# Altium project Motherboard.PrjPcb (part 1 of 2)
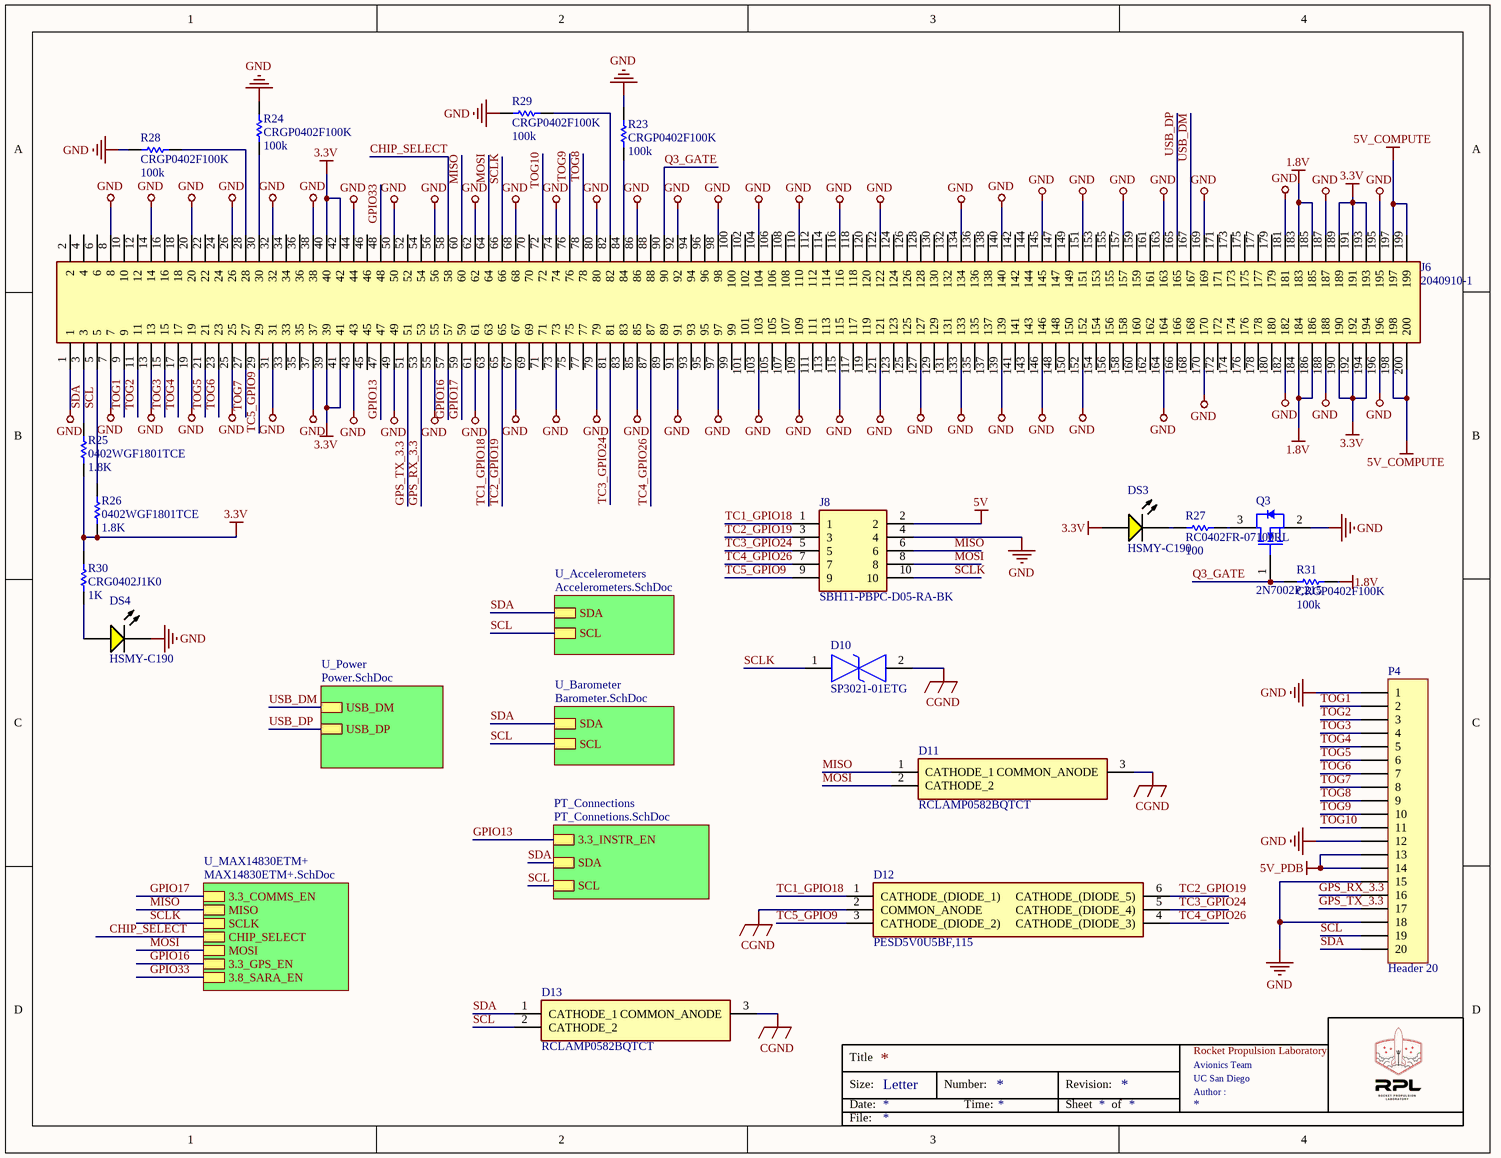
[diagram p0: Top.SchDoc]
9 sheets, 120 parts. Net scope: hierarchical (ports join the sheet entries above them; power ports are global).
Board file: FCB_REV3.PcbDoc
Sheets:
  Top.SchDoc
    U_Accelerometers = Accelerometers.SchDoc
    U_Barometer = Barometer.SchDoc
    U_MAX14830ETM+ = MAX14830ETM+.SchDoc
      U_Cell_SARA-G350-02S = Cell_SARA-G350-02S.SchDoc
      U_MAX3488AEGSA+ = MAX3488AEGSA+.SchDoc
      U_GPS_MAX-M8C-0-10 = GPS_MAX-M8C-0-10.SchDoc
    U_Power = Power.SchDoc
    PT_Connections = PT_Connetions.SchDoc

## Sheet Top.SchDoc
size Letter

### Parts
D10  SP3021-01ETG  [SP302101ETG]
D11  RCLAMP0582BQTCT  [SOT50P160X90-3N]
D12  PESD5V0U5BF,115  [PESD5V0U5BF115]
D13  RCLAMP0582BQTCT  [SOT50P160X90-3N]
DS3  HSMY-C190  [AVAG-HSMX-C190_V]
DS4  HSMY-C190  [AVAG-HSMX-C190_V]
J6  2040910-1  [20409101]
J8  SBH11-PBPC-D05-RA-BK  [SHDRRA10W64P254_2X5_1270X910X880P]
P4  Header 20  [HDR1X20]
Q3  2N7002P,215  [NXP-SOT23_L]
R23  CRGP0402F100K  value 100k  [0402]
R24  CRGP0402F100K  value 100k  [0402]
R25  0402WGF1801TCE  value 1.8K  [0402]
R26  0402WGF1801TCE  value 1.8K  [0402]
R27  RC0402FR-07100RL  spec: 100  [RESC1005X40X25ML05T10]
R28  CRGP0402F100K  value 100k  [0402]
R29  CRGP0402F100K  value 100k  [0402]
R30  CRG0402J1K0  value 1K  [0402]
R31  CRGP0402F100K  value 100k  [0402]

### Sub-sheets
PT_Connections = PT_Connetions.SchDoc: 3.3_INSTR_EN, SDA, SCL
U_Accelerometers = Accelerometers.SchDoc: SDA, SCL
U_Barometer = Barometer.SchDoc: SDA, SCL
U_MAX14830ETM+ = MAX14830ETM+.SchDoc: 3.3_COMMS_EN, MISO, SCLK, CHIP_SELECT, MOSI, 3.3_GPS_EN, 3.8_SARA_EN
U_Power = Power.SchDoc: USB_DM, USB_DP

### Nets
1.8V: J6.183 J6.184 J6.185 J6.186 R31.2
3.3V: DS3.1(A) J6.39 J6.40 J6.41 J6.42 J6.189 J6.190 J6.191 J6.192 J6.193 J6.194 R25.1 R26.1 R30.1
5V: J8.2
5V_COMPUTE: J6.197 J6.198 J6.199 J6.200
5V_PDB: P4.13 P4.14
CGND: D10.2 D11.3(COMMON_ANODE) D12.2(COMMON_ANODE) D13.3(COMMON_ANODE)
GND: DS4.2(K) J6.1 J6.7 J6.8 J6.13 J6.14 J6.19 J6.20 J6.25 J6.26 J6.31 J6.32 J6.37 J6.38 J6.43 J6.44 J6.49 J6.50 J6.55 J6.56 J6.61 J6.62 J6.67 J6.68 J6.73 J6.74 J6.79 J6.80 J6.85 J6.86 J6.91 J6.92 J6.97 J6.98 J6.103 J6.104 J6.109 J6.110 J6.115 J6.116 J6.121 J6.122 J6.127 J6.133 J6.134 J6.139 J6.140 J6.145 J6.146 J6.151 J6.152 J6.157 J6.163 J6.164 J6.169 J6.170 J6.181 J6.182 J6.187 J6.188 J6.195 J6.196 J8.4 P4.1 P4.12 P4.15 P4.18 Q3.2(S) R23.2 R24.2 R28.2 R29.2
CHIP_SELECT: J6.58 ; sheet U_MAX14830ETM+/CHIP_SELECT
GPIO13: J6.47 ; sheet PT_Connections/3.3_INSTR_EN
GPIO16: J6.57 ; sheet U_MAX14830ETM+/3.3_GPS_EN  [project net 3.3_GPS_EN]
GPIO17: J6.59 ; sheet U_MAX14830ETM+/3.3_COMMS_EN  [project net 3.3_COMMS_EN]
GPIO33: J6.48 ; sheet U_MAX14830ETM+/3.8_SARA_EN  [project net 3.8_SARA_EN]
GPS_RX_3.3: J6.53 P4.16
GPS_TX_3.3: J6.51 P4.17
MISO: D11.1(CATHODE_1) J6.60 J8.6 ; sheet U_MAX14830ETM+/MISO
MOSI: D11.2(CATHODE_2) J6.64 J8.8 ; sheet U_MAX14830ETM+/MOSI
Q3_GATE: J6.90 Q3.1(G) R31.1
SCL: D13.2(CATHODE_2) J6.5 P4.19 R26.2 ; sheet U_Accelerometers/SCL, sheet U_Barometer/SCL, sheet PT_Connections/SCL
SCLK: D10.1 J6.66 J8.10 ; sheet U_MAX14830ETM+/SCLK
SDA: D13.1(CATHODE_1) J6.3 P4.20 R25.2 ; sheet U_Accelerometers/SDA, sheet U_Barometer/SDA, sheet PT_Connections/SDA
TC1_GPIO18: D12.1(CATHODE_(DIODE_1)) J6.63 J8.1
TC2_GPIO19: D12.6(CATHODE_(DIODE_5)) J6.65 J8.3
TC3_GPIO24: D12.5(CATHODE_(DIODE_4)) J6.81 J8.5
TC4_GPIO26: D12.4(CATHODE_(DIODE_3)) J6.87 J8.7
TC5_GPIO9: D12.3(CATHODE_(DIODE_2)) J6.29 J8.9
TOG1: J6.9 P4.2
TOG2: J6.11 P4.3
TOG3: J6.15 P4.4
TOG4: J6.17 P4.5
TOG5: J6.21 P4.6
TOG6: J6.23 P4.7
TOG7: J6.27 P4.8
TOG8: J6.78 P4.9
TOG9: J6.76 P4.10
TOG10: J6.72 P4.11
USB_DM: J6.167 ; sheet U_Power/USB_DM
USB_DP: J6.165 ; sheet U_Power/USB_DP
NetDS3_2: DS3.2(K) R27.2
NetDS4_1: DS4.1(A) R30.2
NetJ6_28: J6.28 R28.1
NetJ6_30: J6.30 R24.1
NetJ6_82: J6.82 R29.1
NetJ6_84: J6.84 R23.1
NetQ3_3: Q3.3(D) R27.1

Not connected (* = marked no-connect by the designer): J6 2 4 6 10 12 16 18 22 24 33 34 35 36 45 46 52 54 69 70 71 75 77 83 88 89 93 94 95 96 99 100 101 102 105 106 107 108 111 112 113 114 117 118 119 120 123 124 125 126 128 129 130 131 132 135 136 137 138 141 142 143 144 147 148 149 150 153 154 155 156 158 159 160 161 162 166 168 171 172 173 174 175 176 177 178 179 180

### Notes on the sheet
- Title
- Size:
- Date:
- Letter
- Number:
- Time:
- Revision:
- Sheet
- of
- Rocket Propulsion Laboratory
- UC San Diego
- Avionics Team
- Author :
- File:

### Library data of the parts
D10 = SP3021-01ETG: TVS Diode (Bi-directional); Manufacturer_Name: LITTELFUSE; Datasheet Link: http://www.farnell.com/datasheets/2301234.pdf; Height: 0.6mm; Manufacturer_Part_Number: SP3021-01ETG; Arrow Part Number: SP3021-01ETG; Arrow Price/Stock: https://www.arrow.com/en/products/sp3021-01etg/littelfuse; Mouser Part Number: 576-SP3021-01ETG; Mouser Price/Stock: https://www.mouser.co.uk/ProductDetail/Littelfuse/SP3021-01ETG?qs=Dj8dEyEphkMM8WgFF2cfqw%3D%3D
D11 D13 = RCLAMP0582BQTCT: TVS Diode (Uni-directional); Manufacturer_Name: SEMTECH; Datasheet Link: https://www.semtech.com/uploads/documents/rclamp0582bq.pdf; Height: 0.9mm; Manufacturer_Part_Number: RCLAMP0582BQTCT; Arrow Part Number: RCLAMP0582BQTCT; Arrow Price/Stock: https://www.arrow.com/en/products/rclamp0582bqtct/semtech; Mouser Part Number: 947-RCLAMP0582BQTCT; Mouser Price/Stock: https://www.mouser.co.uk/ProductDetail/Semtech/RCLAMP0582BQTCT?qs=rBWM4%252BvDhIdyuNQteOG89g%3D%3D
D12 = PESD5V0U5BF,115: TVS Diode (Uni-directional); Manufacturer_Name: Nexperia; Datasheet Link: https://assets.nexperia.com/documents/data-sheet/PESD5V0U5BF_PESD5V0U5BV.pdf; Height: 0.5mm; Manufacturer_Part_Number: PESD5V0U5BF,115; Arrow Part Number: PESD5V0U5BF,115; Arrow Price/Stock: https://www.arrow.com/en/products/pesd5v0u5bf115/nexperia; Mouser Part Number: 771-PESD5V0U5BF,115; Mouser Price/Stock: https://www.mouser.co.uk/ProductDetail/Nexperia/PESD5V0U5BF115?qs=PJ263BbL1t3SJO%2F8qTg1Uw%3D%3D
DS3 DS4 = CMP-1744-00003-1: LED Uni-Color Yellow, 65 mW, 20 mA, -40 to 85 degC, 2-Pin SMD, RoHS, Tape and Reel; Tolerance: 1%; Voltage Rating: 50 V; Power Rating: 100 mW; Case\Package: 0603; Resistance: 390 Ohm; Min Operating Temperature: -55 degC; Length: 1.6 mm; ComponentLink3Description: Package Specification; Mount: Surface Mount; PackageReference: HSMX-C190; ComponentLink2Description: Datasheet; DatasheetVersion: Mar-12; Case Code (Metric): 1608; Pins: 2; Package Quantity: 5000; ComponentLink2URL: http://docs.avagotech.com/docs/AV02-0551EN; ComponentLink1Description: Manufacturer URL; RoHSCompliant: true; Packaging: Tape and Reel; PackageDescription: 2-Pin Surface Mount Device, Body 1.6 x 0.8 mm, Height 0.9 mm; REACH SVHC: No SVHC; ComponentLink3URL: http://www.fairchildsemi.com/dwg/MA/MA03D.pdf; Voltage Rating (DC): 50 V; Width: 0.8 mm; ComponentLink1URL: http://www.avagotech.com/; Max Operating Temperature: 155 degC; Case Code (Imperial): 0603; Height: 0.45 mm
J6 = 2040910-1: Connector; Manufacturer_Name: TE Connectivity; Datasheet Link: https://www.arrow.com/en/products/2040910-1/te-connectivity; Height: 15mm; Manufacturer_Part_Number: 2040910-1; Arrow Part Number: 2040910-1; Arrow Price/Stock: https://www.arrow.com/en/products/2040910-1/te-connectivity; Mouser Part Number: 571-2040910-1; Mouser Price/Stock: https://www.mouser.co.uk/ProductDetail/TE-Connectivity/2040910-1?qs=kAqyOuzYGe9tF8FZbDgYRA%3D%3D
J8 = SBH11-PBPC-D05-RA-BK: Connector; Manufacturer_Name: Sullins; Datasheet Link: http://sullinscorp.com/catalogs/145_PAGE118_.100_SBH11_SERIES_MALE_BOX_HDR_ST_RA_SMT.pdf; Height: 8.8mm; Manufacturer_Part_Number: SBH11-PBPC-D05-RA-BK; Arrow Part Number: SBH11-PBPC-D05-RA-BK
P4 = Header 20: Header, 20-Pin; LatestRevisionDate: 17-Jul-2002; LatestRevisionNote: Re-released for DXP Platform.; Publisher: Altium Limited
Q3 = CMP-1259-00082-1: N-Channel Trench MOSFET, 60 V, 0.36 A, -55 to 150 degC, 3-Pin SOT23, Tape and Reel; Manufacturer: NXP Semiconductors; Channel Type: N; Automotive Qualified: Y; VDS [max] (V): 60; Packing: Tape & Reel; ID [max] (A): 0.36; VGSth [typ] (V): 1.75; IDM [max] (A): 1.2; ComponentLink2URL: http://www.nxp.com/documents/data_sheet/2N7002P.pdf; PackageReference: SOT23; PackageVersion: 06-03-16, 03/2006; ComponentLink1URL: http://www.nxp.com/; ComponentLink2Description: Datasheet; Mounting Technology: Surface Mount; PackageDescription: 3-Pin Small Outline Transistor Package, Body 2.9 x 1.3 mm, Pitch 0.95 mm; Code_JEDEC: TO-236AB; ComponentLink1Description: Manufacturer URL; PartNumber: 2N7002P,215; ComponentLink3Description: Package Specification; DatasheetVersion: Rev. 02; ComponentLink3URL: http://www.nxp.com/documents/outline_drawing/sot023_po.pdf
R23-R26 R28-R31 = Res1: Resistor; Published: 8-Jun-2000; LatestRevisionDate: 17-Jul-2002; LatestRevisionNote: Re-released for DXP Platform.; PackageReference: AXIAL-0.3; Publisher: Altium Limited; PackageDescription: Axial Device, Thru-Hole; 2 Leads; 0.3 in Pin Spacing
R27 = CMP-2002-07344-1: Manufacturer: Yageo / Phycomp; Part Number: RC0402FR-07100RL

## Sheet Accelerometers.SchDoc
size Letter
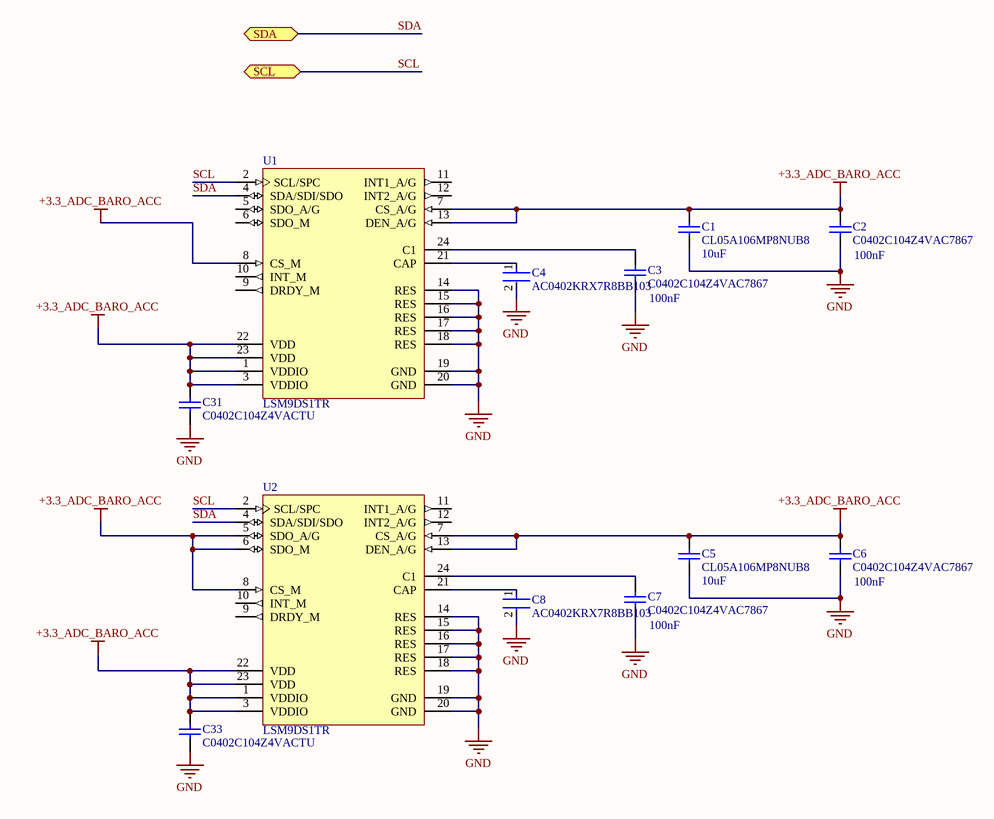
[diagram p1: Accelerometers.SchDoc]

### Parts
C1  CL05A106MP8NUB8  value 10uF  [0402]
C2  C0402C104Z4VAC7867  Spec: 100nF  [CAPC1005X60X30LL05T10]
C3  C0402C104Z4VAC7867  Spec: 100nF  [CAPC1005X60X30LL05T10]
C4  AC0402KRX7R8BB103  [FP-AC0402-0_5-MFG]
C5  CL05A106MP8NUB8  value 10uF  [0402]
C6  C0402C104Z4VAC7867  Spec: 100nF  [CAPC1005X60X30LL05T10]
C7  C0402C104Z4VAC7867  Spec: 100nF  [CAPC1005X60X30LL05T10]
C8  AC0402KRX7R8BB103  [FP-AC0402-0_5-MFG]
C31  C0402C104Z4VACTU  [CAPC1005X55X30LL05T10]
C33  C0402C104Z4VACTU  [CAPC1005X55X30LL05T10]
U1  LSM9DS1TR  [STM-LGA-24_3500X3000X1000]
U2  LSM9DS1TR  [STM-LGA-24_3500X3000X1000]

### Ports
SCL (bidir), SDA (bidir)

### Nets
+3.3_ADC_BARO_ACC: C1.2 C2.2 C5.2 C6.2 C31.2 C33.2 U1.1(VDDIO) U1.3(VDDIO) U1.7(CS_A/G) U1.8(CS_M) U1.13(DEN_A/G) U1.22(VDD) U1.23(VDD) U2.1(VDDIO) U2.3(VDDIO) U2.5(SDO_A/G) U2.6(SDO_M) U2.7(CS_A/G) U2.8(CS_M) U2.13(DEN_A/G) U2.22(VDD) U2.23(VDD)
GND: C1.1 C2.1 C3.1 C4.2 C5.1 C6.1 C7.1 C8.2 C31.1 C33.1 U1.14(RES) U1.15(RES) U1.16(RES) U1.17(RES) U1.18(RES) U1.19(GND) U1.20(GND) U2.14(RES) U2.15(RES) U2.16(RES) U2.17(RES) U2.18(RES) U2.19(GND) U2.20(GND)
SCL: U1.2(SCL/SPC) U2.2(SCL/SPC) ; port SCL
SDA: U1.4(SDA/SDI/SDO) U2.4(SDA/SDI/SDO) ; port SDA
NetC3_2: C3.2 U1.24(C1)
NetC4_1: C4.1 U1.21(CAP)
NetC7_2: C7.2 U2.24(C1)
NetC8_1: C8.1 U2.21(CAP)

Not connected (* = marked no-connect by the designer): U1 5(SDO_A/G) 6(SDO_M) 9(DRDY_M) 10(INT_M) 11(INT1_A/G) 12(INT2_A/G); U2 9(DRDY_M) 10(INT_M) 11(INT1_A/G) 12(INT2_A/G)

### Notes on the sheet
- Title
- Size:
- Date:
- Letter
- Number:
- Time:
- Revision:
- Sheet
- of
- Rocket Propulsion Laboratory
- UC San Diego
- Avionics Team
- Author :
- File:

### Library data of the parts
C1 C5 = Cap: Capacitor; Published: 8-Jun-2000; LatestRevisionDate: 17-Jul-2002; LatestRevisionNote: Re-released for DXP Platform.; PackageReference: RAD-0.3; Publisher: Altium Limited; PackageDescription: Radial Cap, Thru-Hole; 2 Leads; 0.3 in Pin Spacing
C2 C3 C6 C7 = CMP-2008-02369-1: Manufacturer: Kemet; Part Number: C0402C104Z4VAC7867
C4 C8 = CMP-03422-001250-1: CAP CER 10000PF 25V X7R 0402; Manufacturer: Yageo; Capacitance: 10 nF; Value: 10 nF; Material: Ceramic; Automotive Grade: Grade 1; Tolerance: 0.1; Temperature Coefficient: ±15%; Device Class L2: Capacitors; Temperature: -55°C to +125°C; Temperature Characteristic: X7R; Automotive: Yes; Lead Free: Yes; Ipc Land Pattern Name: CAPC10050X50; ComponentLink2Description: Datasheet; Temperature Range High: +125°C; ComponentLink2URL: http://www.yageo.com/documents/recent/UPY-AC_NP0X7R_16V-to-630V_12.pdf; Category: Cap; Octopart: https://octopart.com/ac0402krx7r8bb103-yageo-75666114; Device Class L1: Passive Components; Digikey Description: CAP CER 10000PF 25V X7R 0402; Footprint Url: http://www.yageo.com/exep/pages/download/literatures/UPY-C_GEN_24.pdf; Voltage Rating: 25 V; Temperature Range Low: -55°C; Height: 0.55mm; Manufacturer Part Number: AC0402KRX7R8BB103; RoHS: TRUE; Device Class L3: Ceramic Capacitors; Package: AC0402-0.5
C31 C33 = CMP-2008-03088-1: Manufacturer: Kemet; Part Number: C0402C104Z4VACTU
U1 U2 = CMP-2000-06606-1: iNEMO Inertial Module: 3D Accelerometer, 3D Gyroscope, 3D Magnetometer, 1.9 to 3.6 V, -40 to 85 degC, 24-Pin LGA, RoHS, Tape and Reel; Manufacturer: STMicroelectronics; SVHC: NoSVHC(17-Dec-2015); MEMS Module Function: Tri-AxisGyroscope,Tri-AxisAccelerometer,Tri-AxisMagnetometer; Supply Voltage Max: 3.6V; No. of Pins: 24Pins; Gyroscope Range: ±245°/s,±500°/s,±2000°/s; Acceleration Range: ±2g,±4g,±8g,±16g; Supply Voltage Min: 1.9V; Package Description: 24-Pin Plastic Land Grid Array Package, Body 3.65 x 3.15 mm, Pitch 0.43 mm; Manufacturer URL: http://www.st.com/; PartNumber: LSM9DS1; Product Range: -; Packaging: CutTape; Sensor Case Style: LGA; Datasheet URL: http://www2.st.com/content/ccc/resource/technical/document/datasheet/1e/3f/2a/d6/25/eb/48/46/DM00103319.pdf/files/DM00103319.pdf/jcr:content/translations/en.DM00103319.pdf; Package Reference: LGA-24_3500X3000X1000; Mounting Technology: SurfaceMount; Datasheet Version: Rev. 3, 03/2015; MSL: MSL3-168hours

## Sheet Barometer.SchDoc
size Letter
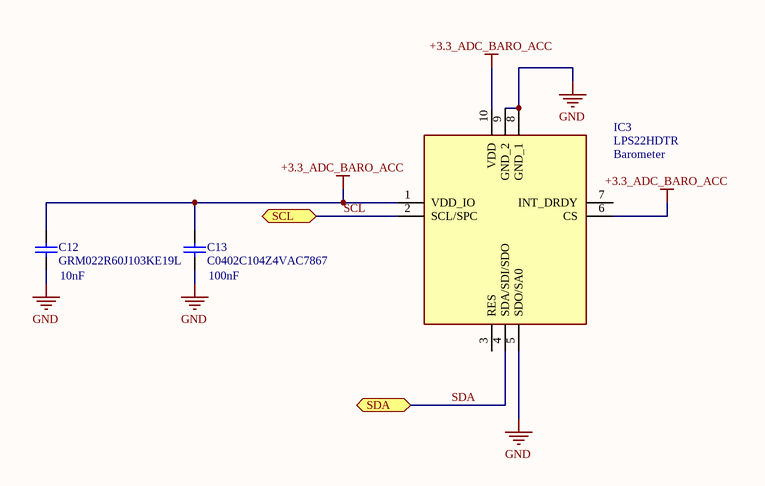
[diagram p2: Barometer.SchDoc]

### Parts
C12  GRM022R60J103KE19L  Spec: 10nF  [CAPC1005X55X25NL05T10]
C13  C0402C104Z4VAC7867  Spec: 100nF  [CAPC1005X60X30LL05T10]
IC3  LPS22HDTR  [LPS22HDTR]

### Ports
SCL (bidir), SDA (bidir)

### Nets
+3.3_ADC_BARO_ACC: C12.2 C13.2 IC3.1(VDD_IO) IC3.6(CS) IC3.10(VDD)
GND: C12.1 C13.1 IC3.5(SDO/SA0) IC3.8(GND_1) IC3.9(GND_2)
SCL: IC3.2(SCL/SPC) ; port SCL
SDA: IC3.4(SDA/SDI/SDO) ; port SDA

Not connected (* = marked no-connect by the designer): IC3 3(RES) 7(INT_DRDY)

### Notes on the sheet
- (near IC3) Barometer
- Title
- Size:
- Date:
- Letter
- Number:
- Time:
- Revision:
- Sheet
- of
- Rocket Propulsion Laboratory
- UC San Diego
- Avionics Team
- Author :
- File:

### Library data of the parts
C12 = CMP-2008-04044-1: Manufacturer: Murata; Part Number: GRM022R60J103KE19L
C13 = CMP-2008-02369-1: Manufacturer: Kemet; Part Number: C0402C104Z4VAC7867
IC3 = LPS22HDTR: Integrated Circuit; Manufacturer_Name: STMicroelectronics; Datasheet Link: https://www.st.com/resource/en/datasheet/lps22hd.pdf; Height: 0.8mm; Manufacturer_Part_Number: LPS22HDTR; Arrow Part Number: LPS22HDTR; Arrow Price/Stock: https://www.arrow.com/en/products/lps22hdtr/stmicroelectronics; Mouser Part Number: 511-LPS22HDTR; Mouser Price/Stock: https://www.mouser.co.uk/ProductDetail/STMicroelectronics/LPS22HDTR?qs=qVqInAHJvrZgdoVrJXJCrw%3D%3D

## Sheet MAX14830ETM+.SchDoc
size Letter
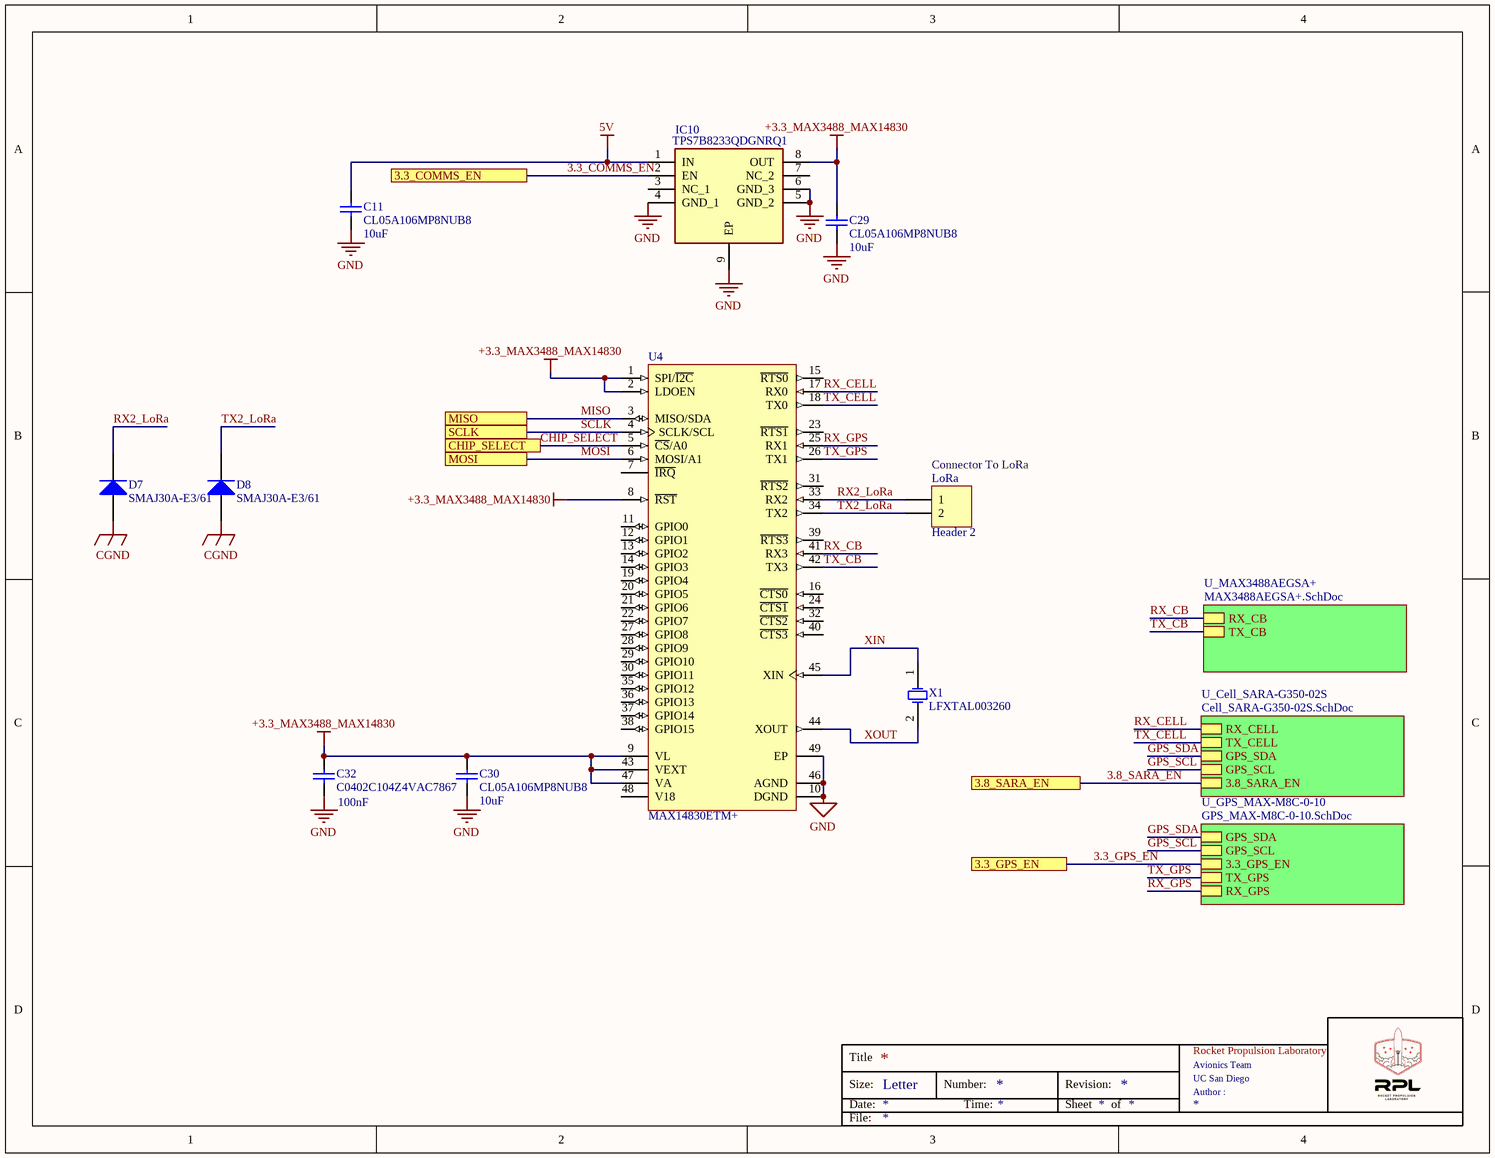
[diagram p3: MAX14830ETM+.SchDoc]

### Parts
C11  CL05A106MP8NUB8  value 10uF  [0402]
C29  CL05A106MP8NUB8  value 10uF  [0402]
C30  CL05A106MP8NUB8  value 10uF  [0402]
C32  C0402C104Z4VAC7867  Spec: 100nF  [CAPC1005X60X30LL05T10]
D7  SMAJ30A-E3/61  [VISH-DO-214AC-2_N]
D8  SMAJ30A-E3/61  [VISH-DO-214AC-2_N]
IC10  TPS7B8233QDGNRQ1  [SOP65P490X110-9N]
LoRa  Header 2  [HDR1X2]
U4  MAX14830ETM+  [T4877+3_M]
X1  LFXTAL003260  [ABRA-ABLS2-2_V]

### Sub-sheets
U_Cell_SARA-G350-02S = Cell_SARA-G350-02S.SchDoc: RX_CELL, TX_CELL, GPS_SDA, GPS_SCL, 3.8_SARA_EN
U_GPS_MAX-M8C-0-10 = GPS_MAX-M8C-0-10.SchDoc: GPS_SDA, GPS_SCL, 3.3_GPS_EN, TX_GPS, RX_GPS
U_MAX3488AEGSA+ = MAX3488AEGSA+.SchDoc: RX_CB, TX_CB

### Ports
3.3_COMMS_EN, 3.3_GPS_EN, 3.8_SARA_EN, CHIP_SELECT, MISO, MOSI, SCLK

### Nets
5V: C11.2 IC10.1(IN)
+3.3_MAX3488_MAX14830: C29.2 C30.2 C32.2 IC10.8(OUT) U4.1(SPI/~{I2C}) U4.2(LDOEN) U4.8(~{RST}) U4.9(VL) U4.43(VEXT) U4.47(VA)
CGND: D7.2(A) D8.2(A)
GND: C11.1 C29.1 C30.1 C32.1 IC10.4(GND_1) IC10.5(GND_2) IC10.6(GND_3) IC10.9(EP) U4.10(DGND) U4.46(AGND) U4.49(EP)
3.3_COMMS_EN: IC10.2(EN) ; port 3.3_COMMS_EN
3.3_GPS_EN: port 3.3_GPS_EN, sheet U_GPS_MAX-M8C-0-10/3.3_GPS_EN
3.8_SARA_EN: port 3.8_SARA_EN, sheet U_Cell_SARA-G350-02S/3.8_SARA_EN
CHIP_SELECT: U4.5(~{CS}/A0) ; port CHIP_SELECT
GPS_SCL: sheet U_Cell_SARA-G350-02S/GPS_SCL, sheet U_GPS_MAX-M8C-0-10/GPS_SCL
GPS_SDA: sheet U_Cell_SARA-G350-02S/GPS_SDA, sheet U_GPS_MAX-M8C-0-10/GPS_SDA
MISO: U4.3(MISO/SDA) ; port MISO
MOSI: U4.6(MOSI/A1) ; port MOSI
RX2_LoRa: D7.1(K) LoRa.1 U4.33(RX2)
RX_CB: U4.41(RX3) ; sheet U_MAX3488AEGSA+/RX_CB
RX_CELL: U4.17(RX0) ; sheet U_Cell_SARA-G350-02S/RX_CELL
RX_GPS: U4.25(RX1) ; sheet U_GPS_MAX-M8C-0-10/RX_GPS
SCLK: U4.4(SCLK/SCL) ; port SCLK
TX2_LoRa: D8.1(K) LoRa.2 U4.34(TX2)
TX_CB: U4.42(TX3) ; sheet U_MAX3488AEGSA+/TX_CB
TX_CELL: U4.18(TX0) ; sheet U_Cell_SARA-G350-02S/TX_CELL
TX_GPS: U4.26(TX1) ; sheet U_GPS_MAX-M8C-0-10/TX_GPS
XIN: U4.45(XIN) X1.1(X1)
XOUT: U4.44(XOUT) X1.2(X2)

Not connected (* = marked no-connect by the designer): IC10 3(NC_1) 7(NC_2); U4 7(~{IRQ}) 11(GPIO0) 12(GPIO1) 13(GPIO2) 14(GPIO3) 15(~{RTS0}) 16(~{CTS0}) 19(GPIO4) 20(GPIO5) 21(GPIO6) 22(GPIO7) 23(~{RTS1}) 24(~{CTS1}) 27(GPIO8) 28(GPIO9) 29(GPIO10) 30(GPIO11) 31(~{RTS2}) 32(~{CTS2}) 35(GPIO12) 36(GPIO13) 37(GPIO14) 38(GPIO15) 39(~{RTS3}) 40(~{CTS3}) 48(V18)

### Notes on the sheet
- (near LoRa) Connector To LoRa
- Title
- Size:
- Date:
- Letter
- Number:
- Time:
- Revision:
- Sheet
- of
- Rocket Propulsion Laboratory
- UC San Diego
- Avionics Team
- Author :
- File:

### Library data of the parts
C11 C29 C30 = Cap: Capacitor; Published: 8-Jun-2000; LatestRevisionDate: 17-Jul-2002; LatestRevisionNote: Re-released for DXP Platform.; PackageReference: RAD-0.3; Publisher: Altium Limited; PackageDescription: Radial Cap, Thru-Hole; 2 Leads; 0.3 in Pin Spacing
C32 = CMP-2008-02369-1: Manufacturer: Kemet; Part Number: C0402C104Z4VAC7867
D7 D8 = CMP-0548-00228-2: Transient Voltage Suppressor, 6.40 to 231 V, 30 V Stand-off Voltage, Uni-Directional, -55 to 155 degC, 2-pin DO-214AC, Pb-Free, Tape and Reel; Manufacturer: Vishay Semiconductor; ID (uA): 1; VWM (V): 30; IFSM: 40 A; PPPM (W): 400, 300; VBR Uni-Directional (V): 6.4 to 231; Mounting Technology: Surface Mount; Packing: Tape and Reel; ComponentLink1URL: http://www.vishay.com/; ComponentLink3URL: http://www.vishay.com/docs/88390/smaj50a.pdf; DatasheetVersion: 12/8/2013; RoHS: TRUE; PartNumber: SMAJ30A-E3/61; PackageReference: DO-214AC-2; ComponentLink2URL: http://www.vishay.com/docs/88390/smaj50a.pdf; ComponentLink1Description: Manufacturer URL; Operating Junction and Storage Temperature Range: -55 to 150 degC; PackageDescription: 2-Pin DO-214AC (SMA), Body 4.245 x 2.665 mm; ComponentLink3Description: Package Specification; ComponentLink2Description: Datasheet
IC10 = TPS7B8233QDGNRQ1: Integrated Circuit; Manufacturer_Name: Texas Instruments; Datasheet Link: http://www.ti.com/lit/gpn/tps7b82-q1; Height: 1.1mm; Manufacturer_Part_Number: TPS7B8233QDGNRQ1; Arrow Part Number: TPS7B8233QDGNRQ1; Arrow Price/Stock: https://www.arrow.com/en/products/tps7b8233qdgnrq1/texas-instruments; Mouser Part Number: 595-TPS7B8233QDGNRQ1; Mouser Price/Stock: https://www.mouser.co.uk/ProductDetail/Texas-Instruments/TPS7B8233QDGNRQ1?qs=gTYE2QTfZfTgserf%2FHg6KA%3D%3D
LoRa = Header 2: Header, 2-Pin; LatestRevisionDate: 17-Jul-2002; LatestRevisionNote: Re-released for DXP Platform.; Publisher: Altium Limited
U4 = CMP-0250-00007-1: Quad Serial UART with 128-Word FIFO, 48-Pin TQFN, -40°C to +85°C, Pb-Free; ComponentLink3URL: http://pdfserv.maxim-ic.com/package_dwgs/21-0144.PDF; ComponentLink2Description: Datasheet; ComponentLink1URL: http://www.maxim-ic.com; ComponentLink3Description: Package Specification; PackageVersion: revI, 2009; DatasheetVersion: Rev 2, Sep-2011; ComponentLink1Description: Manufacturer URL; PackageReference: T4877+3; ComponentLink2URL: http://datasheets.maxim-ic.com/en/ds/MAX14830.pdf; PackageDescription: 48-Pin Thin Quad Flatpack, No Leads, 7 x 7 x 0.75 mm Body, 0.5 mm Pitch, TQFN, Pb-Free
X1 = CMP-0277-00002-1: Low Profile Surface Mount Microprocessor Crystal, 4.096 MHz +/-30 ppm, 180 Ohm, -40 to 85 degC, 2-Pin 11.4 x 4.7 x 3.3 mm SMD, RoHS, Tape and Reel; Manufacturer: Abracon; PartNumber: ABLS2-4.096MHZ-D4Y-T; Operation Mode: Fundamental or 3rd Overtone; Shunt Capacitance: 7 pF Max.; ESR: 180 Ohm; Load Capacitance: 18 pF; Mounting Technology: Surface Mount; PackageDescription: 2-Pin SMD, Body 11.4 x 4.7 mm, Height 3.3 mm; ComponentLink1URL: http://www.abracon.com/; Freq. Stability: +/- 30 ppm; ComponentLink2Description: Datasheet; Operating Temp. Range: -40 to 85 degC; Packing: Tape and Reel; RoHS: TRUE; PackageReference: ABLS2-2; DatasheetVersion: Rev. 03.31.11; Freq. Tolerance: +/- 30 ppm; Frequency: 4.096 MHz; ComponentLink2URL: http://www.abracon.com/Resonators/ABLS2.pdf; ComponentLink1Description: Manufacturer URL

## Sheet Cell_SARA-G350-02S.SchDoc
size Letter
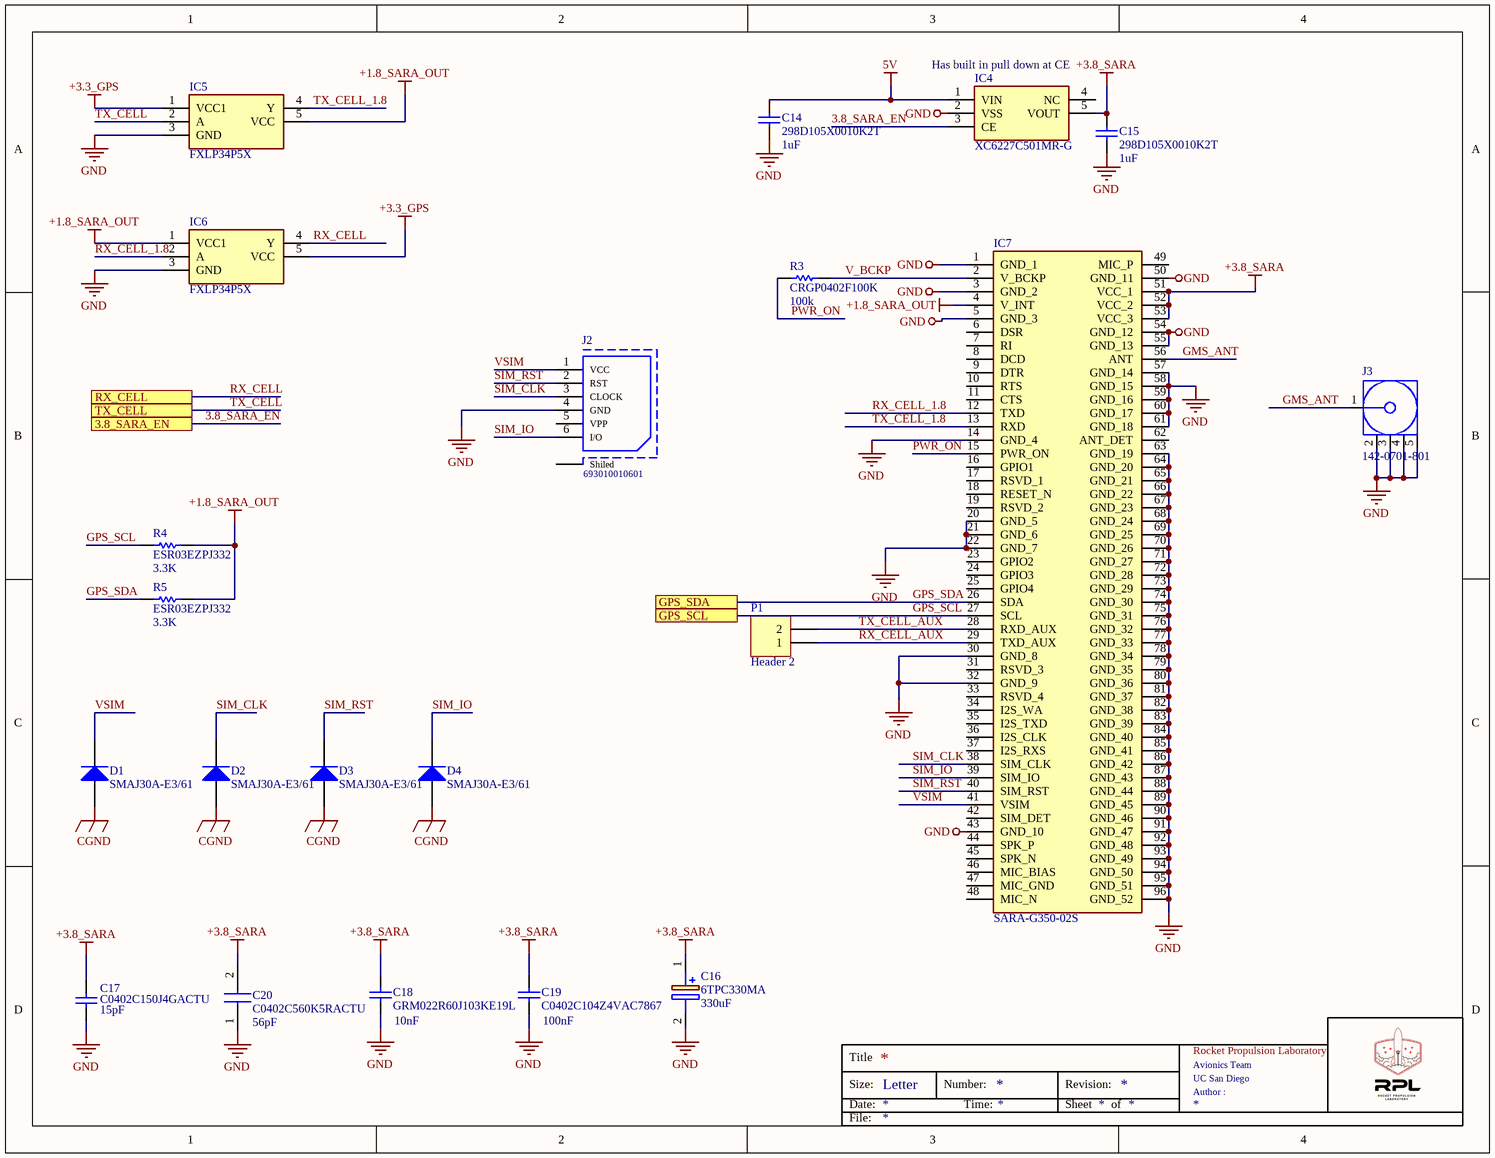
[diagram p4: Cell_SARA-G350-02S.SchDoc]

### Parts
C14  298D105X0010K2T  value 1uF  [0402]
C15  298D105X0010K2T  value 1uF  [0402]
C16  6TPC330MA  spec: 330uF  [CAPPM7343X200N]
C17  C0402C150J4GACTU  value 15pF  [CAPC0402(1005)60_L]
C18  GRM022R60J103KE19L  Spec: 10nF  [CAPC1005X55X25NL05T10]
C19  C0402C104Z4VAC7867  Spec: 100nF  [CAPC1005X60X30LL05T10]
C20  C0402C560K5RACTU  spec: 56pF  [CAPC1005X55N]
D1  SMAJ30A-E3/61  [VISH-DO-214AC-2_N]
D2  SMAJ30A-E3/61  [VISH-DO-214AC-2_N]
D3  SMAJ30A-E3/61  [VISH-DO-214AC-2_N]
D4  SMAJ30A-E3/61  [VISH-DO-214AC-2_N]
IC4  XC6227C501MR-G  [SOT95P280X130-5N]
IC5  FXLP34P5X  [SOT65P210X110-5N]
IC6  FXLP34P5X  [SOT65P210X110-5N]
IC7  SARA-G350-02S  [SARA-G350_1]
J2  693010010601  [693010010601]
J3  142-0701-801  [CINC-142-0701-801_V]
P1  Header 2  [HDR1X2]
R3  CRGP0402F100K  value 100k  [0402]
R4  ESR03EZPJ332  value 3.3K  [1608[0603]]
R5  ESR03EZPJ332  value 3.3K  [1608[0603]]

### Ports
3.8_SARA_EN, GPS_SCL, GPS_SDA, RX_CELL, TX_CELL

### Nets
5V: C14.2 IC4.1(VIN)
+1.8_SARA_OUT: IC5.5(VCC) IC6.1(VCC1) IC7.4(V_INT) R4.2 R5.2
+3.3_GPS: IC5.1(VCC1) IC6.5(VCC)
+3.8_SARA: C15.2 C16.1(+) C17.2 C18.2 C19.2 C20.2 IC4.5(VOUT) IC7.51(VCC_1) IC7.52(VCC_2) IC7.53(VCC_3)
CGND: D1.2(A) D2.2(A) D3.2(A) D4.2(A)
GND: C14.1 C15.1 C16.2(-) C17.1 C18.1 C19.1 C20.1 IC4.2(VSS) IC5.3(GND) IC6.3(GND) IC7.1(GND_1) IC7.3(GND_2) IC7.5(GND_3) IC7.14(GND_4) IC7.20(GND_5) IC7.21(GND_6) IC7.22(GND_7) IC7.30(GND_8) IC7.32(GND_9) IC7.43(GND_10) IC7.50(GND_11) IC7.54(GND_12) IC7.55(GND_13) IC7.57(GND_14) IC7.58(GND_15) IC7.59(GND_16) IC7.60(GND_17) IC7.61(GND_18) IC7.63(GND_19) IC7.64(GND_20) IC7.65(GND_21) IC7.66(GND_22) IC7.67(GND_23) IC7.68(GND_24) IC7.69(GND_25) IC7.70(GND_26) IC7.71(GND_27) IC7.72(GND_28) IC7.73(GND_29) IC7.74(GND_30) IC7.75(GND_31) IC7.76(GND_32) IC7.77(GND_33) IC7.78(GND_34) IC7.79(GND_35) IC7.80(GND_36) IC7.81(GND_37) IC7.82(GND_38) IC7.83(GND_39) IC7.84(GND_40) IC7.85(GND_41) IC7.86(GND_42) IC7.87(GND_43) IC7.88(GND_44) IC7.89(GND_45) IC7.90(GND_46) IC7.91(GND_47) IC7.92(GND_48) IC7.93(GND_49) IC7.94(GND_50) IC7.95(GND_51) IC7.96(GND_52) J2.4(GND) J3.2 J3.3 J3.4 J3.5
3.8_SARA_EN: IC4.3(CE) ; port 3.8_SARA_EN
GMS_ANT: IC7.56(ANT) J3.1
GPS_SCL: IC7.27(SCL) R4.1 ; port GPS_SCL
GPS_SDA: IC7.26(SDA) R5.1 ; port GPS_SDA
PWR_ON: IC7.15(PWR_ON) R3.2
RX_CELL: IC6.4(Y) ; port RX_CELL
RX_CELL_1.8: IC6.2(A) IC7.12(TXD)
RX_CELL_AUX: IC7.29(TXD_AUX) P1.1
SIM_CLK: D2.1(K) IC7.38(SIM_CLK) J2.3(CLOCK)
SIM_IO: D4.1(K) IC7.39(SIM_IO) J2.6(I/O)
SIM_RST: D3.1(K) IC7.40(SIM_RST) J2.2(RST)
TX_CELL: IC5.2(A) ; port TX_CELL
TX_CELL_1.8: IC5.4(Y) IC7.13(RXD)
TX_CELL_AUX: IC7.28(RXD_AUX) P1.2
V_BCKP: IC7.2(V_BCKP) R3.1
VSIM: D1.1(K) IC7.41(VSIM) J2.1(VCC)

Not connected (* = marked no-connect by the designer): IC4 4(NC); IC7 6(DSR) 7(RI) 8(DCD) 9(DTR) 10(RTS) 11(CTS) 16(GPIO1) 17(RSVD_1) 18(RESET_N) 19(RSVD_2) 23(GPIO2) 24(GPIO3) 25(GPIO4) 31(RSVD_3) 33(RSVD_4) 34(I2S_WA) 35(I2S_TXD) 36(I2S_CLK) 37(I2S_RXS) 42(SIM_DET) 44(SPK_P) 45(SPK_N) 46(MIC_BIAS) 47(MIC_GND) 48(MIC_N) 49(MIC_P) 62(ANT_DET); J2 5(VPP) Shiled

### Notes on the sheet
- (near IC4) Has built in pull down at CE
- Title
- Size:
- Date:
- Letter
- Number:
- Time:
- Revision:
- Sheet
- of
- Rocket Propulsion Laboratory
- UC San Diego
- Avionics Team
- Author :
- File:

### Library data of the parts
C14 C15 = Cap: Capacitor; Published: 8-Jun-2000; LatestRevisionDate: 17-Jul-2002; LatestRevisionNote: Re-released for DXP Platform.; PackageReference: RAD-0.3; Publisher: Altium Limited; PackageDescription: Radial Cap, Thru-Hole; 2 Leads; 0.3 in Pin Spacing
C16 = 6TPC330MA: Capacitor Polarised; Manufacturer_Name: Panasonic; Datasheet Link: https://industrial.panasonic.com/cdbs/www-data/pdf/AAA8000/AAA8000C68.pdf; Height: 2mm; Manufacturer_Part_Number: 6TPC330MA; Mouser Part Number: 667-6TPC330MA; Mouser Price/Stock: https://www.mouser.com/Search/Refine.aspx?Keyword=667-6TPC330MA; RS Part Number: 7887368P; RS Price/Stock: http://au.rs-online.com/web/p/products/7887368P
C17 = CMP-1034-00802-1: CAP 15pF 16V ±5% 0402 (1005 Metric) Thickness 0.6mm SMD; Case-EIA: 0402; Case-Metric: 1005; Tolerance: Â±5%; Max Thickness: 0.6 mm; Technology: SMT; Rated Voltage: 16 V
C18 = CMP-2008-04044-1: Manufacturer: Murata; Part Number: GRM022R60J103KE19L
C19 = CMP-2008-02369-1: Manufacturer: Kemet; Part Number: C0402C104Z4VAC7867
C20 = C0402C560K5RACTU: Capacitor; Manufacturer_Name: Kemet; Datasheet Link: https://content.kemet.com/datasheets/KEM_C1002_X7R_SMD.pdf; Height: 0.55mm; Manufacturer_Part_Number: C0402C560K5RACTU; Mouser Part Number: 80-C0402C560K5RACTU; Mouser Price/Stock: https://www.mouser.com/Search/Refine.aspx?Keyword=80-C0402C560K5RACTU
D1-D4 = CMP-0548-00228-2: as D7 on sheet MAX14830ETM+; Mounting Technology: Surface Mount; Packing: Tape and Reel; ComponentLink1URL: http://www.vishay.com/; ComponentLink3URL: http://www.vishay.com/docs/88390/smaj50a.pdf; DatasheetVersion: 12/8/2013; RoHS: TRUE; PartNumber: SMAJ30A-E3/61; PackageReference: DO-214AC-2; ComponentLink2URL: http://www.vishay.com/docs/88390/smaj50a.pdf; ComponentLink1Description: Manufacturer URL; Operating Junction and Storage Temperature Range: -55 to 150 degC; PackageDescription: 2-Pin DO-214AC (SMA), Body 4.245 x 2.665 mm; ComponentLink3Description: Package Specification; ComponentLink2Description: Datasheet
IC4 = XC6227C501MR-G: Integrated Circuit; Manufacturer_Name: Torex; Datasheet Link: https://www.torexsemi.com/file/xc6227/XC6227.pdf; Height: 1.3mm; Manufacturer_Part_Number: XC6227C501MR-G; Arrow Part Number: XC6227C501MR-G; Mouser Part Number: 865-XC6227C501MR-G; Mouser Price/Stock: https://www.mouser.co.uk/ProductDetail/Torex-Semiconductor/XC6227C501MR-G?qs=AsjdqWjXhJ85%252BgmQqME4lA%3D%3D
IC5 IC6 = FXLP34P5X: Integrated Circuit; Manufacturer_Name: ON Semiconductor; Datasheet Link: https://www.onsemi.com/pub/Collateral/FXLP34-D.pdf; Height: 1.1mm; Manufacturer_Part_Number: FXLP34P5X; Arrow Part Number: FXLP34P5X; Arrow Price/Stock: https://www.arrow.com/en/products/fxlp34p5x/on-semiconductor; Mouser Part Number: 512-FXLP34P5X; Mouser Price/Stock: https://www.mouser.com/Search/Refine.aspx?Keyword=512-FXLP34P5X
IC7 = SARA-G350-02S: Integrated Circuit; Manufacturer_Name: U-Blox; Datasheet Link: https://www.u-blox.com/sites/default/files/SARA-G3_DataSheet_%28UBX-13000993%29.pdf; Manufacturer_Part_Number: SARA-G350-02S
J2 = CMP-1502-00154-1: WR-CRD Mini SIM Card Connector Header; Manufacturer: Wurth Elektronik; Working Voltage: 50VAC; Rated Current: 0.5A; Withstanding Voltage: 500VAC; Publisher: WurthElektronik; Part Number: 693010010601; Operating Temperature: -25to85degC; Packaging: TapeandReel; Datasheet URL: https://katalog.we-online.de/em/datasheet/693010010601.pdf; Package Reference: 693010010601; Mounting Technology: SMT; Manufacturer URL: http://www.we-online.de
J3 = CMP-2000-05490-1: SMA End Launch Jack Receptacle, 50 Ohm, 0 to 18 GHz, -65 to 165 degC, 5-Pin SMD, RoHS, Bulk; Manufacturer: EmersonConnectivitySolutions; Connector Type: JackPCB; Gender: Jack(Female); Impedance: 50Ohms; Brand: Johnson/EmersonConnectivitySolutions; Body Material: Brass; Body Style: Straight; Maximum Frequency: 18GHz; Factory Pack Quantity: 5; Datasheet URL: https://belfuse.com/resources/Johnson/productinformation/pi-142-0701-801.pdf; Datasheet Version: 12/2014; Operating Temperature Range: -65Cto+165C; Mounting Technology: SurfaceMount; RF Series: SMA; Package Reference: 142-0701-801; Product Category: RFConnectors/CoaxialConnectors; Termination Style: Solder; RoHS: Details; Package URL: https://belfuse.com/resources/Johnson/drawings/dr-1420701801.pdf; Series: SMA; Package Description: 5-Pin Surface Mount Device, Body 14.275 x 9.525 mm; Manufacturer URL: http://www.cinch.com/; Contact Plating: Gold; Product: Connectors; Orientation: Straight
P1 = Header 2: Header, 2-Pin; LatestRevisionDate: 17-Jul-2002; LatestRevisionNote: Re-released for DXP Platform.; Publisher: Altium Limited
R3-R5 = Res1: Resistor; Published: 8-Jun-2000; LatestRevisionDate: 17-Jul-2002; LatestRevisionNote: Re-released for DXP Platform.; PackageReference: AXIAL-0.3; Publisher: Altium Limited; PackageDescription: Axial Device, Thru-Hole; 2 Leads; 0.3 in Pin Spacing

## Sheet MAX3488AEGSA+.SchDoc
size Letter
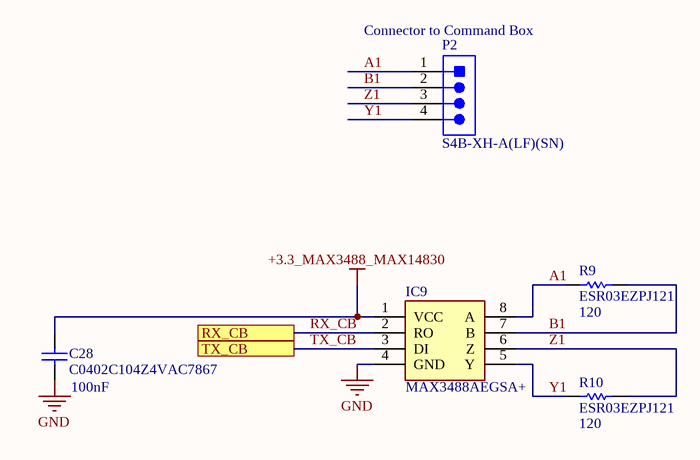
[diagram p5: MAX3488AEGSA+.SchDoc]

### Parts
C28  C0402C104Z4VAC7867  Spec: 100nF  [CAPC1005X60X30LL05T10]
IC9  MAX3488AEGSA+  [SOIC127P600X175-8N]
P2  S4B-XH-A(LF)(SN)  [JST-S4B-XH-A(LF)(SN)_V]
R9  ESR03EZPJ121  value 120  [1608[0603]]
R10  ESR03EZPJ121  value 120  [1608[0603]]

### Ports
RX_CB, TX_CB

### Nets
+3.3_MAX3488_MAX14830: C28.2 IC9.1(VCC)
GND: C28.1 IC9.4(GND)
A1: IC9.8(A) P2.1 R9.1
B1: IC9.7(B) P2.2 R9.2
RX_CB: IC9.2(RO) ; port RX_CB
TX_CB: IC9.3(DI) ; port TX_CB
Y1: IC9.5(Y) P2.4 R10.1
Z1: IC9.6(Z) P2.3 R10.2

### Notes on the sheet
- (near P2) Connector to Command Box
- Title
- Size:
- Date:
- Letter
- Number:
- Time:
- Revision:
- Sheet
- of
- Rocket Propulsion Laboratory
- UC San Diego
- Avionics Team
- Author :
- File:

### Library data of the parts
C28 = CMP-2008-02369-1: Manufacturer: Kemet; Part Number: C0402C104Z4VAC7867
IC9 = MAX3488AEGSA+: Integrated Circuit; Manufacturer_Name: Maxim Integrated; Datasheet Link: https://datasheets.maximintegrated.com/en/ds/MAX3483AE-MAX3491AE.pdf; Height: 1.75mm; Manufacturer_Part_Number: MAX3488AEGSA+; Arrow Part Number: MAX3488AEGSA+; Mouser Part Number: 700-MAX3488AEGSA+; Mouser Price/Stock: https://www.mouser.com/Search/Refine.aspx?Keyword=700-MAX3488AEGSA%2B
P2 = CMP-1755-00007-1: Male Header, Pitch 2.5 mm, 1 x 4 Position, Height 6.1 mm, Tail Length 3.4 mm, -25 to 85 degC, RoHS, Bulk; PackageReference: S4B-XH-A(LF)(SN); ComponentLink1Description: Manufacturer URL; DatasheetVersion: May-16; ComponentLink2Description: Datasheet; ComponentLink2URL: http://www.jst-mfg.com/product/pdf/eng/eXH.pdf; ComponentLink1URL: http://www.jst.com/home2.html; PackageDescription: Male Header, Pitch 2.5 mm, 1 x 4 Position, Height 6.1 mm, Tail Length 3.4 mm
R9 R10 = Res1: Resistor; Published: 8-Jun-2000; LatestRevisionDate: 17-Jul-2002; LatestRevisionNote: Re-released for DXP Platform.; PackageReference: AXIAL-0.3; Publisher: Altium Limited; PackageDescription: Axial Device, Thru-Hole; 2 Leads; 0.3 in Pin Spacing

## Sheet GPS_MAX-M8C-0-10.SchDoc
size Letter
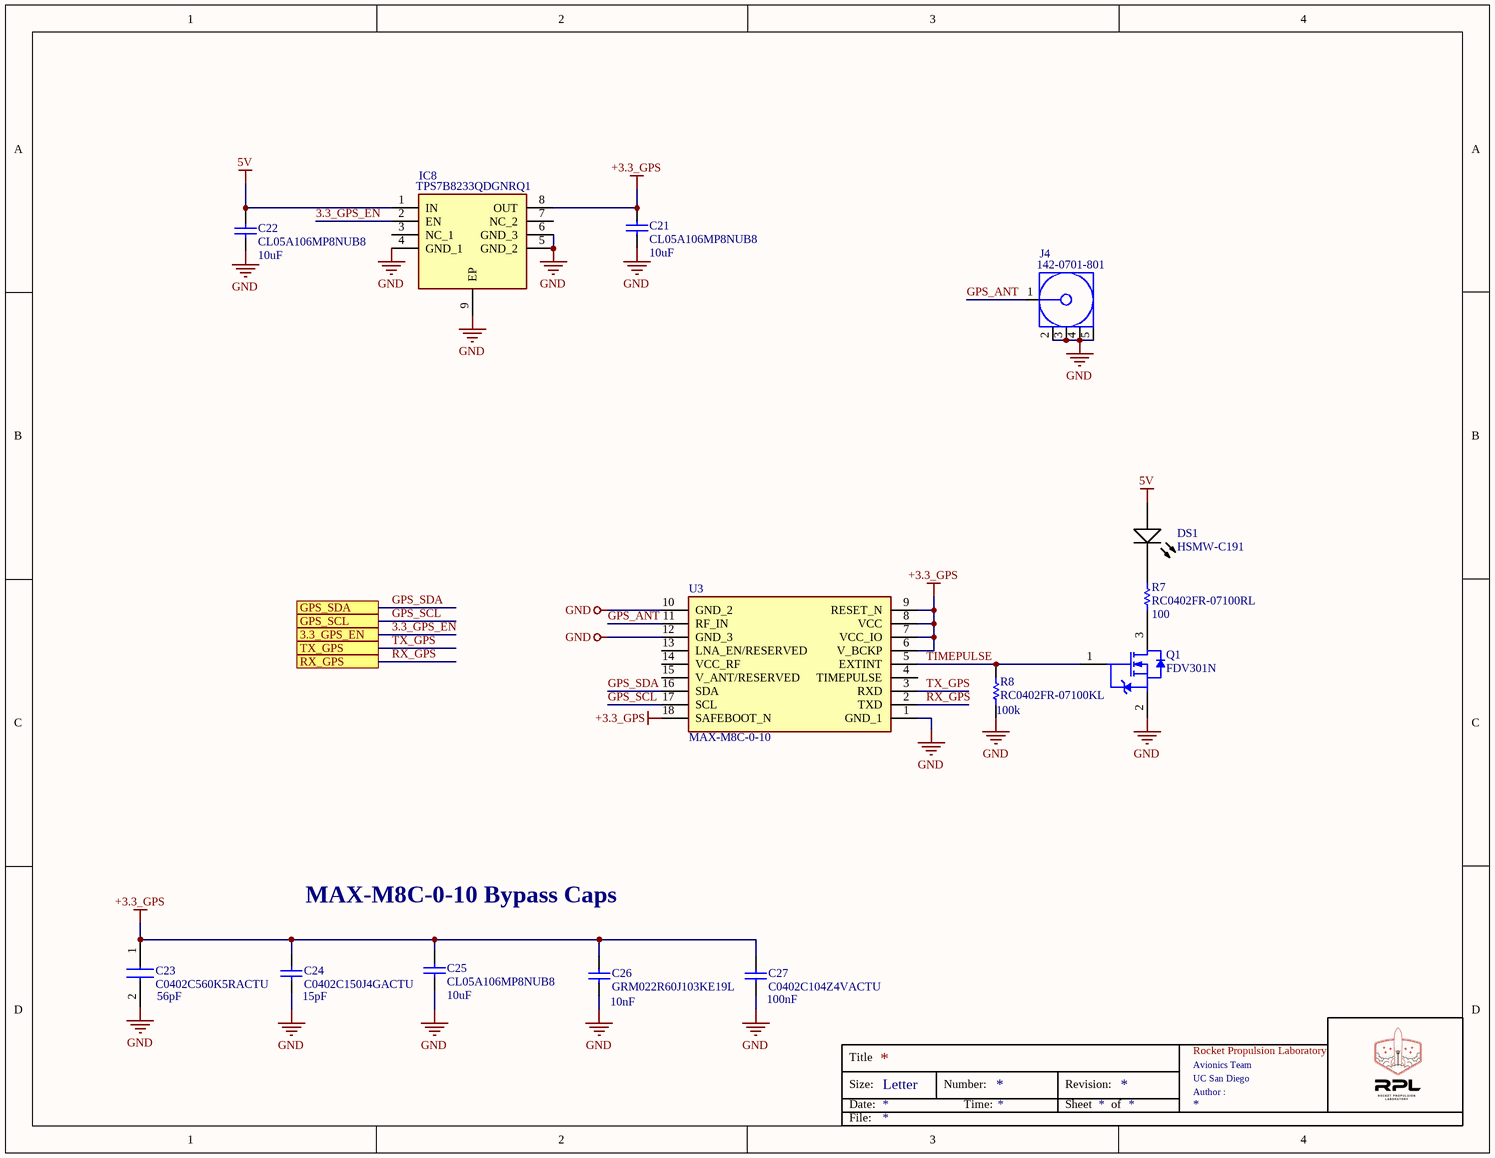
[diagram p6: GPS_MAX-M8C-0-10.SchDoc]

### Parts
C21  CL05A106MP8NUB8  value 10uF  [0402]
C22  CL05A106MP8NUB8  value 10uF  [0402]
C23  C0402C560K5RACTU  value 56pF  [CAPC1005X55N]
C24  C0402C150J4GACTU  value 15pF  [CAPC0402(1005)60_L]
C25  CL05A106MP8NUB8  value 10uF  [0402]
C26  GRM022R60J103KE19L  value 10nF  [CAPC1005X55X25NL05T10]
C27  C0402C104Z4VACTU  value 100nF  [CAPC1005X55X30LL05T10]
DS1  HSMW-C191  [AVAG-HSMW-C191_V]
IC8  TPS7B8233QDGNRQ1  [SOP65P490X110-9N]
J4  142-0701-801  [CINC-142-0701-801_V]
Q1  FDV301N  [FAIR-SOT23-3_V]
R7  RC0402FR-07100RL  spec: 100  [RESC1005X40X25ML05T10]
R8  RC0402FR-07100KL  spec: 100k  [RESC1005X40X25NL05T10]
U3  MAX-M8C-0-10  [MAX-M8]

### Ports
3.3_GPS_EN, GPS_SCL, GPS_SDA, RX_GPS, TX_GPS

### Nets
5V: C22.2 DS1.1(A) IC8.1(IN)
+3.3_GPS: C21.2 C23.1 C24.1 C25.2 C26.2 C27.2 IC8.8(OUT) U3.6(V_BCKP) U3.7(VCC_IO) U3.8(VCC) U3.9(RESET_N) U3.18(SAFEBOOT_N)
GND: C21.1 C22.1 C23.2 C24.2 C25.1 C26.1 C27.1 IC8.4(GND_1) IC8.5(GND_2) IC8.6(GND_3) IC8.9(EP) J4.2 J4.3 J4.4 J4.5 Q1.2(S) R8.2 U3.1(GND_1) U3.10(GND_2) U3.12(GND_3)
3.3_GPS_EN: IC8.2(EN) ; port 3.3_GPS_EN
GPS_ANT: J4.1 U3.11(RF_IN)
GPS_SCL: U3.17(SCL) ; port GPS_SCL
GPS_SDA: U3.16(SDA) ; port GPS_SDA
RX_GPS: U3.2(TXD) ; port RX_GPS
TIMEPULSE: Q1.1(G) R8.1 U3.5(EXTINT)
TX_GPS: U3.3(RXD) ; port TX_GPS
NetDS1_2: DS1.2(K) R7.2
NetQ1_3: Q1.3(D) R7.1

Not connected (* = marked no-connect by the designer): IC8 3(NC_1) 7(NC_2); U3 4(TIMEPULSE) 13(LNA_EN/RESERVED) 14(VCC_RF) 15(V_ANT/RESERVED)

### Notes on the sheet
- MAX-M8C-0-10 Bypass Caps
- Title
- Size:
- Date:
- Letter
- Number:
- Time:
- Revision:
- Sheet
- of
- Rocket Propulsion Laboratory
- UC San Diego
- Avionics Team
- Author :
- File:

### Library data of the parts
C21 C22 C25 = Cap: Capacitor; Published: 8-Jun-2000; LatestRevisionDate: 17-Jul-2002; LatestRevisionNote: Re-released for DXP Platform.; PackageReference: RAD-0.3; Publisher: Altium Limited; PackageDescription: Radial Cap, Thru-Hole; 2 Leads; 0.3 in Pin Spacing
C23 = C0402C560K5RACTU: Capacitor; Manufacturer_Name: Kemet; Datasheet Link: https://content.kemet.com/datasheets/KEM_C1002_X7R_SMD.pdf; Height: 0.55mm; Manufacturer_Part_Number: C0402C560K5RACTU; Arrow Part Number: C0402C560K5RACTU; Mouser Part Number: 80-C0402C560K5RACTU; Mouser Price/Stock: https://www.mouser.co.uk/ProductDetail/KEMET/C0402C560K5RACTU?qs=gt1LBUVyoHmQZW5v3ySgNQ%3D%3D
C24 = CMP-1034-00802-1: as C17 on sheet Cell_SARA-G350-02S; Max Thickness: 0.6 mm; Technology: SMT; Rated Voltage: 16 V
C26 = CMP-2008-04044-1: Manufacturer: Murata; Part Number: GRM022R60J103KE19L
C27 = CMP-2008-03088-1: Manufacturer: Kemet; Part Number: C0402C104Z4VACTU
DS1 = CMP-1744-00001-1: LED Uni-Color White, 78 mW, 20 mA, -40 to 85 degC, 2-Pin SMD, RoHS, Tape and Reel; Current Rating: 300 mA; Contact Plating: Silver; Width: 12 mm; Package Quantity: 560; ComponentLink2URL: http://docs.avagotech.com/docs/AV02-0186EN; ComponentLink1URL: http://www.avagotech.com/; RoHSCompliant: true; PackageDescription: 2-Pin Surface Mount Device, Body 1.6 x 0.8 mm; Contact Material: Copper; ComponentLink1Description: Manufacturer URL; Mount: Through Hole; Packaging: Bulk; DatasheetVersion: May-10; Height: 12 mm; ComponentLink2Description: Datasheet; Contact Finish: Silver; Max Operating Temperature: 85 degC; Radiation Hardening: No; PackageReference: HSMW-C191; REACH SVHC: Unknown; Min Operating Temperature: -20 degC; Length: 16 mm
IC8 = TPS7B8233QDGNRQ1: as IC10 on sheet MAX14830ETM+; Datasheet Link: http://www.ti.com/lit/gpn/tps7b82-q1; Height: 1.1mm; Manufacturer_Part_Number: TPS7B8233QDGNRQ1; Arrow Part Number: TPS7B8233QDGNRQ1; Arrow Price/Stock: https://www.arrow.com/en/products/tps7b8233qdgnrq1/texas-instruments; Mouser Part Number: 595-TPS7B8233QDGNRQ1; Mouser Price/Stock: https://www.mouser.co.uk/ProductDetail/Texas-Instruments/TPS7B8233QDGNRQ1?qs=gTYE2QTfZfTgserf%2FHg6KA%3D%3D
J4 = CMP-2000-05490-1: as J3 on sheet Cell_SARA-G350-02S; Factory Pack Quantity: 5; Datasheet URL: https://belfuse.com/resources/Johnson/productinformation/pi-142-0701-801.pdf; Datasheet Version: 12/2014; Operating Temperature Range: -65Cto+165C; Mounting Technology: SurfaceMount; RF Series: SMA; Package Reference: 142-0701-801; Product Category: RFConnectors/CoaxialConnectors; Termination Style: Solder; RoHS: Details; Package URL: https://belfuse.com/resources/Johnson/drawings/dr-1420701801.pdf; Series: SMA; Package Description: 5-Pin Surface Mount Device, Body 14.275 x 9.525 mm; Manufacturer URL: http://www.cinch.com/; Contact Plating: Gold; Product: Connectors; Orientation: Straight
Q1 = CMP-2000-04935-1: Digital FET, N-Channel, 0.35 W, 25 V, -55 to 150 degC, 3-Pin SOT23, RoHS, Tape and Reel; Manufacturer: Fairchild; Rds(on) Test Voltage Vgs: 2.7V; Threshold Voltage Vgs Typ: 850mV; Voltage Vds Typ: 25V; Transistor Case Style: SOT-23; Reel Quantity: 3000; Voltage Vgs Rds on Measurement: 4.5V; Power Dissipation Pd: 350mW; Continuous Drain Current Id: 220mA; Transistor Polarity: NChannel; No. of Transistors: 1; Package Version: Rev. 12, 03/2016; Voltage Vgs th Max: 1.5V; ESD HBM: 6kV; Pulse Current Idm: 500mA; Current Temperature: 25degC; On Resistance Rds(on): 5ohm; External Depth: 2.5mm; SMD Marking: 301; No. of Pins: 3; External Width: 3.05mm; SVHC: NoSVHC(19-Dec-2012); External Length / Height: 1.12mm; Termination Type: SMD; Package Reference: SOT23-3; Package URL: http://www.fairchildsemi.com/dwg/MA/MA03D.pdf; Voltage Vgs Max: 850mV; Drain Source Voltage Vds: 25V; Operating Temperature Max: 150degC; Package Description: 3-Pin Small Outline Transistor, Body 2.92 x 1.325 mm, Pitch 0.95 mm; Operating Temperature Min: -55degC; Datasheet Version: Jun-09; Tape Width: 8mm; Full Power Rating Temperature: 25degC; Datasheet URL: https://datasheet.ciiva.com/8114/fdv301n-8114688.pdf; Package / Case: SOT-23; Manufacturer URL: https://www.fairchildsemi.com/; Current Id Max: 220mA; Operating Temperature Range: -55degCto+150degC; ComponentLink1Description: datasheety; ComponentLink1URL: https://www.onsemi.com/pub/Collateral/FDV301N-D.PDF
R7 = CMP-2002-07344-1: Manufacturer: Yageo / Phycomp; Part Number: RC0402FR-07100RL
R8 = CMP-2002-07343-1: Manufacturer: Yageo / Phycomp; Part Number: RC0402FR-07100KL
U3 = MAX-M8C-0-10: Undefined or Miscellaneous; Manufacturer_Name: U-Blox; Datasheet Link: https://www.u-blox.com/sites/default/files/MAX-M8-FW3_DataSheet_%28UBX-15031506%29.pdf; Manufacturer_Part_Number: MAX-M8C-0-10; Arrow Part Number: MAX-M8C-0-10

## Sheet Power.SchDoc
size Letter
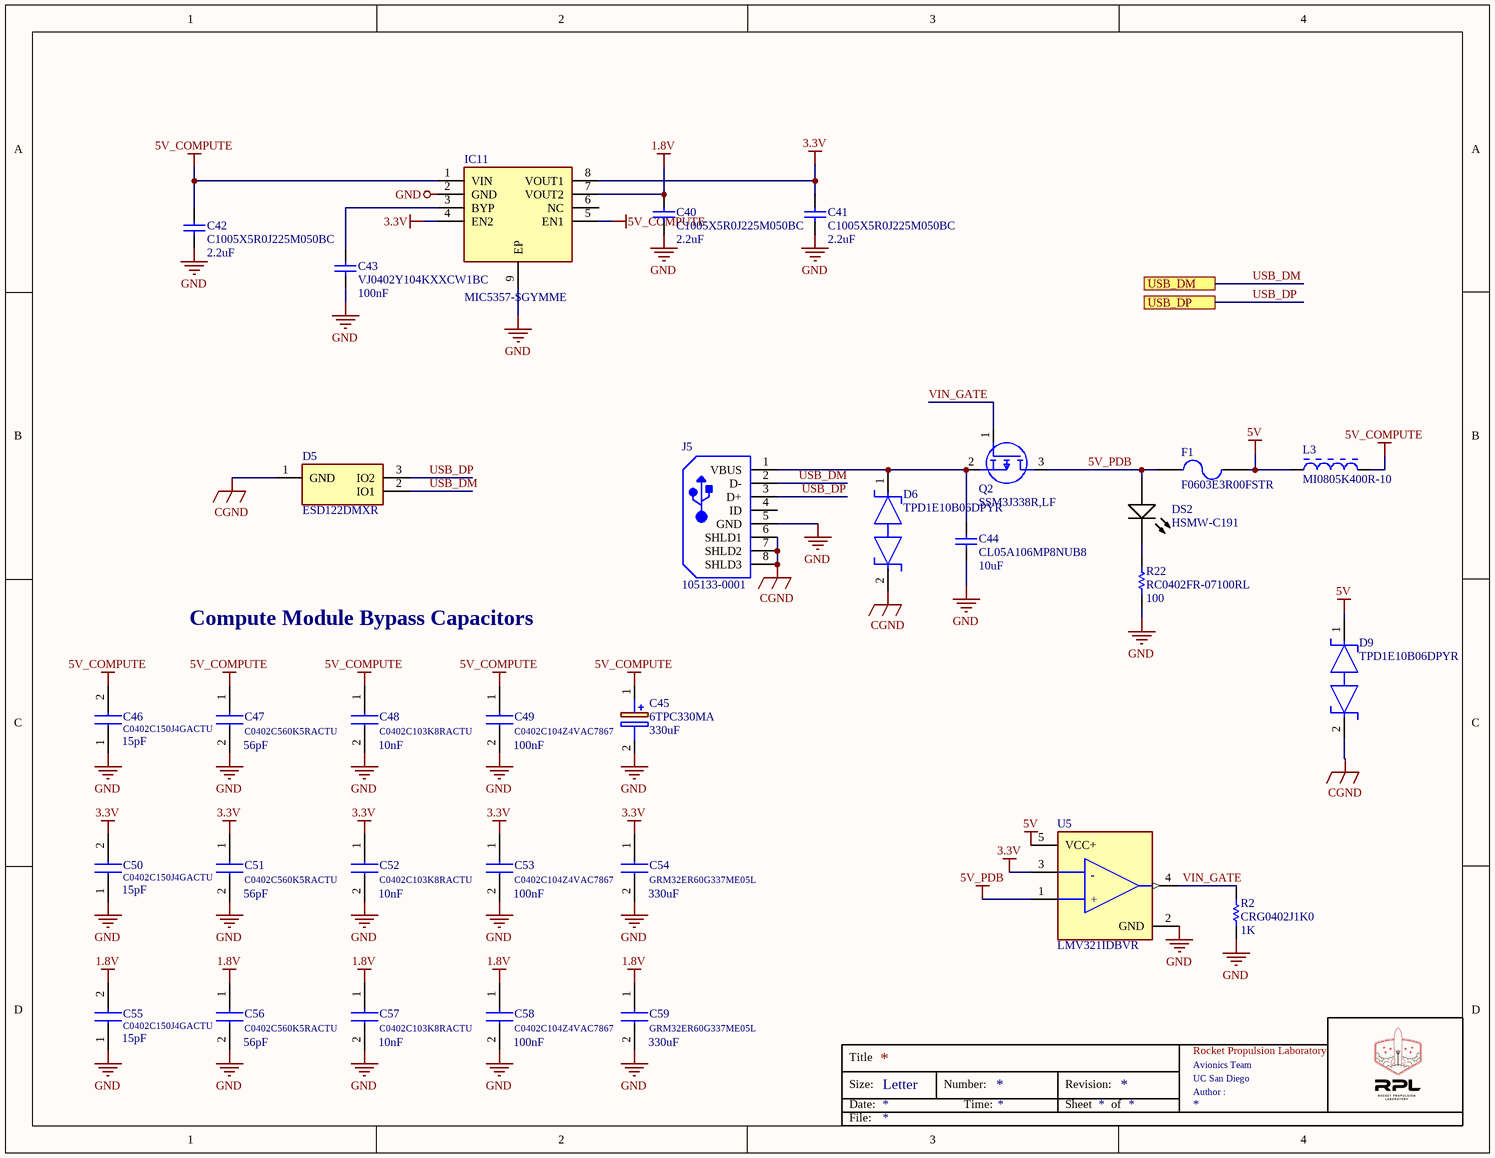
[diagram p7: Power.SchDoc]

### Parts
C40  C1005X5R0J225M050BC  value 2.2uF  [0402]
C41  C1005X5R0J225M050BC  value 2.2uF  [0402]
C42  C1005X5R0J225M050BC  value 2.2uF  [0402]
C43  VJ0402Y104KXXCW1BC  value 100nF  [0402]
C44  CL05A106MP8NUB8  value 10uF  [0402]
C45  6TPC330MA  value 330uF  [CAPPM7343X200N]
C46  C0402C150J4GACTU  value 15pF  [CAPC1005X90N]
C47  C0402C560K5RACTU  value 56pF  [CAPC1005X55N]
C48  C0402C103K8RACTU  value 10nF  [CAPC1005X55N]
C49  C0402C104Z4VAC7867  value 100nF  [CAPC1005X55N]
C50  C0402C150J4GACTU  value 15pF  [CAPC1005X90N]
C51  C0402C560K5RACTU  value 56pF  [CAPC1005X55N]
C52  C0402C103K8RACTU  value 10nF  [CAPC1005X55N]
C53  C0402C104Z4VAC7867  value 100nF  [CAPC1005X55N]
C54  GRM32ER60G337ME05L  value 330uF  [CAPC3225X280N]
C55  C0402C150J4GACTU  value 15pF  [CAPC1005X90N]
C56  C0402C560K5RACTU  value 56pF  [CAPC1005X55N]
C57  C0402C103K8RACTU  value 10nF  [CAPC1005X55N]
C58  C0402C104Z4VAC7867  value 100nF  [CAPC1005X55N]
C59  GRM32ER60G337ME05L  value 330uF  [CAPC3225X280N]
D5  ESD122DMXR  [DMX0003A]
D6  TPD1E10B06DPYR  [FP-DPY0002A-MFG]
D9  TPD1E10B06DPYR  [FP-DPY0002A-MFG]
DS2  HSMW-C191  [AVAG-HSMW-C191_V]
F1  F0603E3R00FSTR  [1608[0603]]
IC11  MIC5357-SGYMME  [SOP65P490X104-9N]
J5  105133-0001  [MOLX-105133-0001_V]
L3  MI0805K400R-10  [LIRD-MI0805K400R-10_V]
Q2  SSM3J338R,LF  [SSM3J332RLFT]
R2  CRG0402J1K0  value 1K  [0402]
R22  RC0402FR-07100RL  spec: 100  [RESC1005X40X25ML05T10]
U5  LMV321IDBVR  [FP-DBV0005A-MFG]

### Ports
USB_DM, USB_DP

### Nets
1.8V: C40.2 C55.2 C56.1 C57.1 C58.1 C59.1 IC11.7(VOUT2)
3.3V: C41.2 C50.2 C51.1 C52.1 C53.1 C54.1 IC11.4(EN2) IC11.8(VOUT1) U5.3(1IN-)
5V: D9.1 F1.2 L3.1 U5.5(VCC+)
5V_COMPUTE: C42.2 C45.1(+) C46.2 C47.1 C48.1 C49.1 IC11.1(VIN) IC11.5(EN1) L3.2
5V_PDB: DS2.1(A) F1.1 Q2.3(D) U5.1(1IN+)
CGND: D5.1(GND) D6.2 D9.2 J5.6(SHLD1) J5.7(SHLD2) J5.8(SHLD3)
GND: C40.1 C41.1 C42.1 C43.1 C44.1 C45.2(-) C46.1 C47.2 C48.2 C49.2 C50.1 C51.2 C52.2 C53.2 C54.2 C55.1 C56.2 C57.2 C58.2 C59.2 IC11.2(GND) IC11.9(EP) J5.5(GND) R2.2 R22.1 U5.2(GND)
USB_DM: D5.2(IO1) J5.2(D-) ; port USB_DM
USB_DP: D5.3(IO2) J5.3(D+) ; port USB_DP
VIN_GATE: Q2.1(G) R2.1 U5.4(OUT)
NetC43_2: C43.2 IC11.3(BYP)
NetC44_2: C44.2 D6.1 J5.1(VBUS) Q2.2(S)
NetDS2_2: DS2.2(K) R22.2

Not connected (* = marked no-connect by the designer): IC11 6(NC); J5 4(ID)

### Notes on the sheet
- Compute Module Bypass Capacitors
- Title
- Size:
- Date:
- Letter
- Number:
- Time:
- Revision:
- Sheet
- of
- Rocket Propulsion Laboratory
- UC San Diego
- Avionics Team
- Author :
- File:
- (in symbol CMP-04895-000056-1) -; +

### Library data of the parts
C40-C44 = Cap: Capacitor; Published: 8-Jun-2000; LatestRevisionDate: 17-Jul-2002; LatestRevisionNote: Re-released for DXP Platform.; PackageReference: RAD-0.3; Publisher: Altium Limited; PackageDescription: Radial Cap, Thru-Hole; 2 Leads; 0.3 in Pin Spacing
C45 = 6TPC330MA: as C16 on sheet Cell_SARA-G350-02S; Datasheet Link: https://industrial.panasonic.com/cdbs/www-data/pdf/AAA8000/AAA8000C68.pdf; Height: 2mm; Manufacturer_Part_Number: 6TPC330MA; Arrow Part Number: 6TPC330MA; Arrow Price/Stock: https://www.arrow.com/en/products/6tpc330ma/panasonic; Mouser Part Number: 667-6TPC330MA; Mouser Price/Stock: https://www.mouser.co.uk/ProductDetail/Panasonic/6TPC330MA?qs=OE1iw1LrrPEq6z1np%252BZymw%3D%3D
C46 C50 C55 = C0402C150J4GACTU: Capacitor; Manufacturer_Name: Kemet; Datasheet Link: https://content.kemet.com/datasheets/KEM_C1002_X7R_SMD.pdf; Height: 0.55mm; Manufacturer_Part_Number: C0402C150J4GACTU; Arrow Part Number: C0402C150J4GACTU; Arrow Price/Stock: https://www.arrow.com/en/products/c0402c150j4gactu/kemet-corporation; Mouser Part Number: 80-C0402C150J4G; Mouser Price/Stock: https://www.mouser.com/Search/Refine.aspx?Keyword=80-C0402C150J4G
C47 C49 C51 C53 C56 C58 = C0402C560K5RACTU: Capacitor; Manufacturer_Name: Kemet; Datasheet Link: https://content.kemet.com/datasheets/KEM_C1002_X7R_SMD.pdf; Height: 0.55mm; Manufacturer_Part_Number: C0402C560K5RACTU; Arrow Part Number: C0402C560K5RACTU; Mouser Part Number: 80-C0402C560K5RACTU; Mouser Price/Stock: https://www.mouser.co.uk/ProductDetail/KEMET/C0402C560K5RACTU?qs=gt1LBUVyoHmQZW5v3ySgNQ%3D%3D
C48 C52 C57 = C0402C103K8RACTU: Capacitor; Manufacturer_Name: Kemet; Datasheet Link: https://content.kemet.com/datasheets/KEM_C1002_X7R_SMD.pdf; Height: 0.55mm; Manufacturer_Part_Number: C0402C103K8RACTU; Arrow Part Number: C0402C103K8RACTU; Arrow Price/Stock: https://www.arrow.com/en/products/c0402c103k8ractu/kemet-corporation; Mouser Part Number: 80-C0402C103K8R; Mouser Price/Stock: https://www.mouser.co.uk/ProductDetail/KEMET/C0402C103K8RACTU?qs=JAINH4q0Y0HkMNTUebnT7w%3D%3D
C54 C59 = GRM32ER60G337ME05L: Capacitor; Manufacturer_Name: Murata Electronics; Datasheet Link: https://componentsearchengine.com/Datasheets/2/GRM32ER60G337ME05L.pdf; Height: 2.8mm; Manufacturer_Part_Number: GRM32ER60G337ME05L; Arrow Part Number: GRM32ER60G337ME05L; Arrow Price/Stock: https://www.arrow.com/en/products/grm32er60g337me05l/murata-manufacturing; Mouser Part Number: 81-GRM32ER60G337ME5L; Mouser Price/Stock: https://www.mouser.co.uk/ProductDetail/Murata-Electronics/GRM32ER60G337ME05L?qs=MzgNgRTiRUU9wX46aOSi8Q%3D%3D
D5 = ESD122DMXR: TVS Diode (Bi-directional); Manufacturer_Name: Texas Instruments; Datasheet Link: http://www.ti.com/lit/gpn/esd122; Manufacturer_Part_Number: ESD122DMXR; Arrow Part Number: ESD122DMXR; Arrow Price/Stock: https://www.arrow.com/en/products/esd122dmxr/texas-instruments; Mouser Part Number: 595-ESD122DMXR; Mouser Price/Stock: https://www.mouser.co.uk/ProductDetail/Texas-Instruments/ESD122DMXR?qs=gt1LBUVyoHlO%2FS8I%252Bb9aFA%3D%3D
D6 D9 = CMP-04985-000006-1: TVS DIODE 5.5V 14V 2X1SON; Leakage Current: 100nA; Min Breakdown Voltage: 6V; Number of Channels: 1; ESD Protection: Yes; Power Line Protection: No; Test Current: 1mA; Interface: GPIO; Element Configuration: Single; Peak Pulse Current: 5A; Direction: Bidirectional; Peak Pulse Power: 90W; Capacitance: 12pF; Composition: Zener; Packaging: Tape and Reel; Number of Pins: 2; Breakdown Voltage: 6V; Radiation Hardening: No; Min Operating Temperature: -40°C; Contact Plating: Gold; Lead Free: Lead Free; Height: 0.35mm; REACH SVHC: No SVHC; Case/Package: 0402; Max Operating Temperature: 125°C; Width: 0.7mm; Clamping Voltage: 14V; Package Quantity: 1; Max Reverse Leakage Current: 100nA; Working Voltage: 5.5V; Length: 1.1mm; Number of Bidirectional Channels: 1; Reverse Standoff Voltage: 5.5V
DS2 = CMP-1744-00001-1: as DS1 on sheet GPS_MAX-M8C-0-10; Contact Plating: Silver; Width: 12 mm; Package Quantity: 560; ComponentLink2URL: http://docs.avagotech.com/docs/AV02-0186EN; ComponentLink1URL: http://www.avagotech.com/; RoHSCompliant: true; PackageDescription: 2-Pin Surface Mount Device, Body 1.6 x 0.8 mm; Contact Material: Copper; ComponentLink1Description: Manufacturer URL; Mount: Through Hole; Packaging: Bulk; DatasheetVersion: May-10; Height: 12 mm; ComponentLink2Description: Datasheet; Contact Finish: Silver; Max Operating Temperature: 85 degC; Radiation Hardening: No; PackageReference: HSMW-C191; REACH SVHC: Unknown; Min Operating Temperature: -20 degC; Length: 16 mm
F1 = Fuse 2: Fuse; Published: 8-Jun-2000; LatestRevisionDate: 17-Jul-2002; LatestRevisionNote: Re-released for DXP Platform.; PackageReference: PIN-W2/E2.8; Publisher: Altium Limited; PackageDescription: Thru-Hole; 2 Leads
IC11 = MIC5357-SGYMME: Integrated Circuit; Manufacturer_Name: Microchip; Datasheet Link: http://ww1.microchip.com/downloads/en/DeviceDoc/mic5357.pdf; Height: 1.04mm; Manufacturer_Part_Number: MIC5357-SGYMME; Arrow Part Number: MIC5357-SGYMME; Arrow Price/Stock: https://www.arrow.com/en/products/mic5357-sgymme/microchip-technology; Mouser Part Number: 998-MIC5357-SGYMME; Mouser Price/Stock: https://www.mouser.com/Search/Refine.aspx?Keyword=998-MIC5357-SGYMME
J5 = CMP-2000-05829-1: Micro-USB B Receptacle, Vertical, -30 to 85 degC, 5-Pin SMD, RoHS, Tape and Reel; Manufacturer: Molex; Package Version: Rev. C, 11/2015; Voltage Rating: 30VAC; Connector Type: MicroUSBTypeBReceptacle; Current Rating: 1.8A; Number of Ports: 1; Voltage - Max: 30V; Mounting Style: SMD/SMT; Packaging: Reel; Product: MicroUSBTypeBConnectors; Contact Plating: Gold; Flammability Rating: UL94V-0; Package Description: 5-Pin Surface Mount Device, Pitch 0.65 mm; Package Reference: 105133-0001; Contact Material: CopperAlloy; Mounting Angle: Vertical; RoHS: Details; Manufacturer URL: http://www.molex.com/; Factory Pack Quantity: 6000; PartNumber: 105133-0001; Standard: USB; Brand: Molex; Series: 105133; Product Category: USBConnectors; Termination Style: SolderTail; Gender: Receptacle; Package URL: http://www.molex.com/pdm_docs/sd/1051330001_sd.pdf; Datasheet Version: 03/2016; Color: Black; Datasheet URL: http://www.molex.com/webdocs/datasheets/pdf/en-us/1051330001_IO_CONNECTORS.pdf; Mounting Technology: SurfaceMount
L3 = CMP-2000-06702-1: Chip Ferrite Bead, 1.5 A, -40 to 125 degC, 2-Pin SMD (0805), RoHS, Tape and Reel; Manufacturer: Laird; Current Rating (Max): 1.5A; Online Catalog: MISeries; Impedance @ Frequency: 40Ohm@100MHz; Catalog Drawings: (HI,HZ,LI,MI)0805Series_1.10mmMax.Height; Other Names: 240-2389-1; Number of Lines: 1; Filter Type: PowerLine; Kits: 240-2227-ND-KITEMIFERRITEBEADCHIPSMD; DC Resistance (DCR) (Max): 50mOhm; Manufacturer URL: https://www.lairdtech.com/; Ratings: -; Mounting Type: SurfaceMount; Family: FerriteBeadsandChips; Package Description: 2-Pin Surface Mount Device, Body 2 x 1.25 mm; Datasheet URL: http://download.siliconexpert.com/pdfs2/2015/9/8/2/39/55/778/laird_/auto/f.pdf; Category: Filters; Standard Package: 1; Series: MI; Operating Temperature: -40°C~125°C; Package Reference: MI0805K400R-10; Mounting Technology: SurfaceMount; Packaging: CutTape(CT); Size / Dimension: 0.079"Lx0.049"W(2.00mmx1.25mm); Height (Max): 0.043"(1.10mm); Package / Case: 0805(2012Metric); Datasheet Version: Rev. D, 08/2013
Q2 = SSM3J338R,LF: MOSFET (P-Channel); Manufacturer_Name: Toshiba; Datasheet Link: http://toshiba.semicon-storage.com/info/docget.jsp?did=30384&prodName=SSM3J338R; Manufacturer_Part_Number: SSM3J338R,LF; Arrow Part Number: SSM3J338R,LF; Arrow Price/Stock: https://www.arrow.com/en/products/ssm3j338rlf/toshiba; Mouser Part Number: 757-SSM3J338RLF; Mouser Price/Stock: https://www.mouser.co.uk/ProductDetail/Toshiba/SSM3J338RLF?qs=lhkzy8lC%252BSvURFM9ZjmJSw%3D%3D
R2 = Res1: Resistor; Published: 8-Jun-2000; LatestRevisionDate: 17-Jul-2002; LatestRevisionNote: Re-released for DXP Platform.; PackageReference: AXIAL-0.3; Publisher: Altium Limited; PackageDescription: Axial Device, Thru-Hole; 2 Leads; 0.3 in Pin Spacing
R22 = CMP-2002-07344-1: Manufacturer: Yageo / Phycomp; Part Number: RC0402FR-07100RL
U5 = CMP-04895-000056-1: IC OPAMP GP 1 CIRCUIT SOT23-5; Manufacturer: Texas Instruments; Bandwidth: 1MHz; Number Of Channels: 1; Max Junction Temp: +150°C; Input Offset Voltage: 1.7mV; Standoff Height: 0mm; Voltage Gain: 100V/mV; Min Supply Voltage: 2.7V; Input Bias Current: 0.015uA; Nominal Supply Current: 80-130uA; Max Supply Voltage: 5.5V; Ambient Temperature Range Low: -40°C; Device Class L3: Amplifiers - Op Amps; Package: DBV0005A; Temperature: -40°C to +125°C; Automotive: No; Ambient Temperature Range High: +125°C; ComponentLink2Description: Datasheet; Manufacturer Part Number: LMV321IDBVR; Octopart: https://octopart.com/lmv321idbvr-texas+instruments-410381; ComponentLink2URL: http://www.ti.com/lit/ds/symlink/lmv321.pdf; Temperature Range High: +125°C; Device Class L1: Integrated Circuits (ICs); Temperature Range Low: -40°C; Digikey Description: IC OPAMP GP 1 CIRCUIT SOT23-5; RoHS: TRUE; Height: 1.45mm; Mouser Description: Operational Amplifiers - Op Amps Low V R/R; Device Class L2: Linear ICs; Gain Bandwidth: 1MHz; Lead Free: Yes; Category: IC